# Altium project iMX6_Pixhawk.PrjPcb (part 1 of 6)
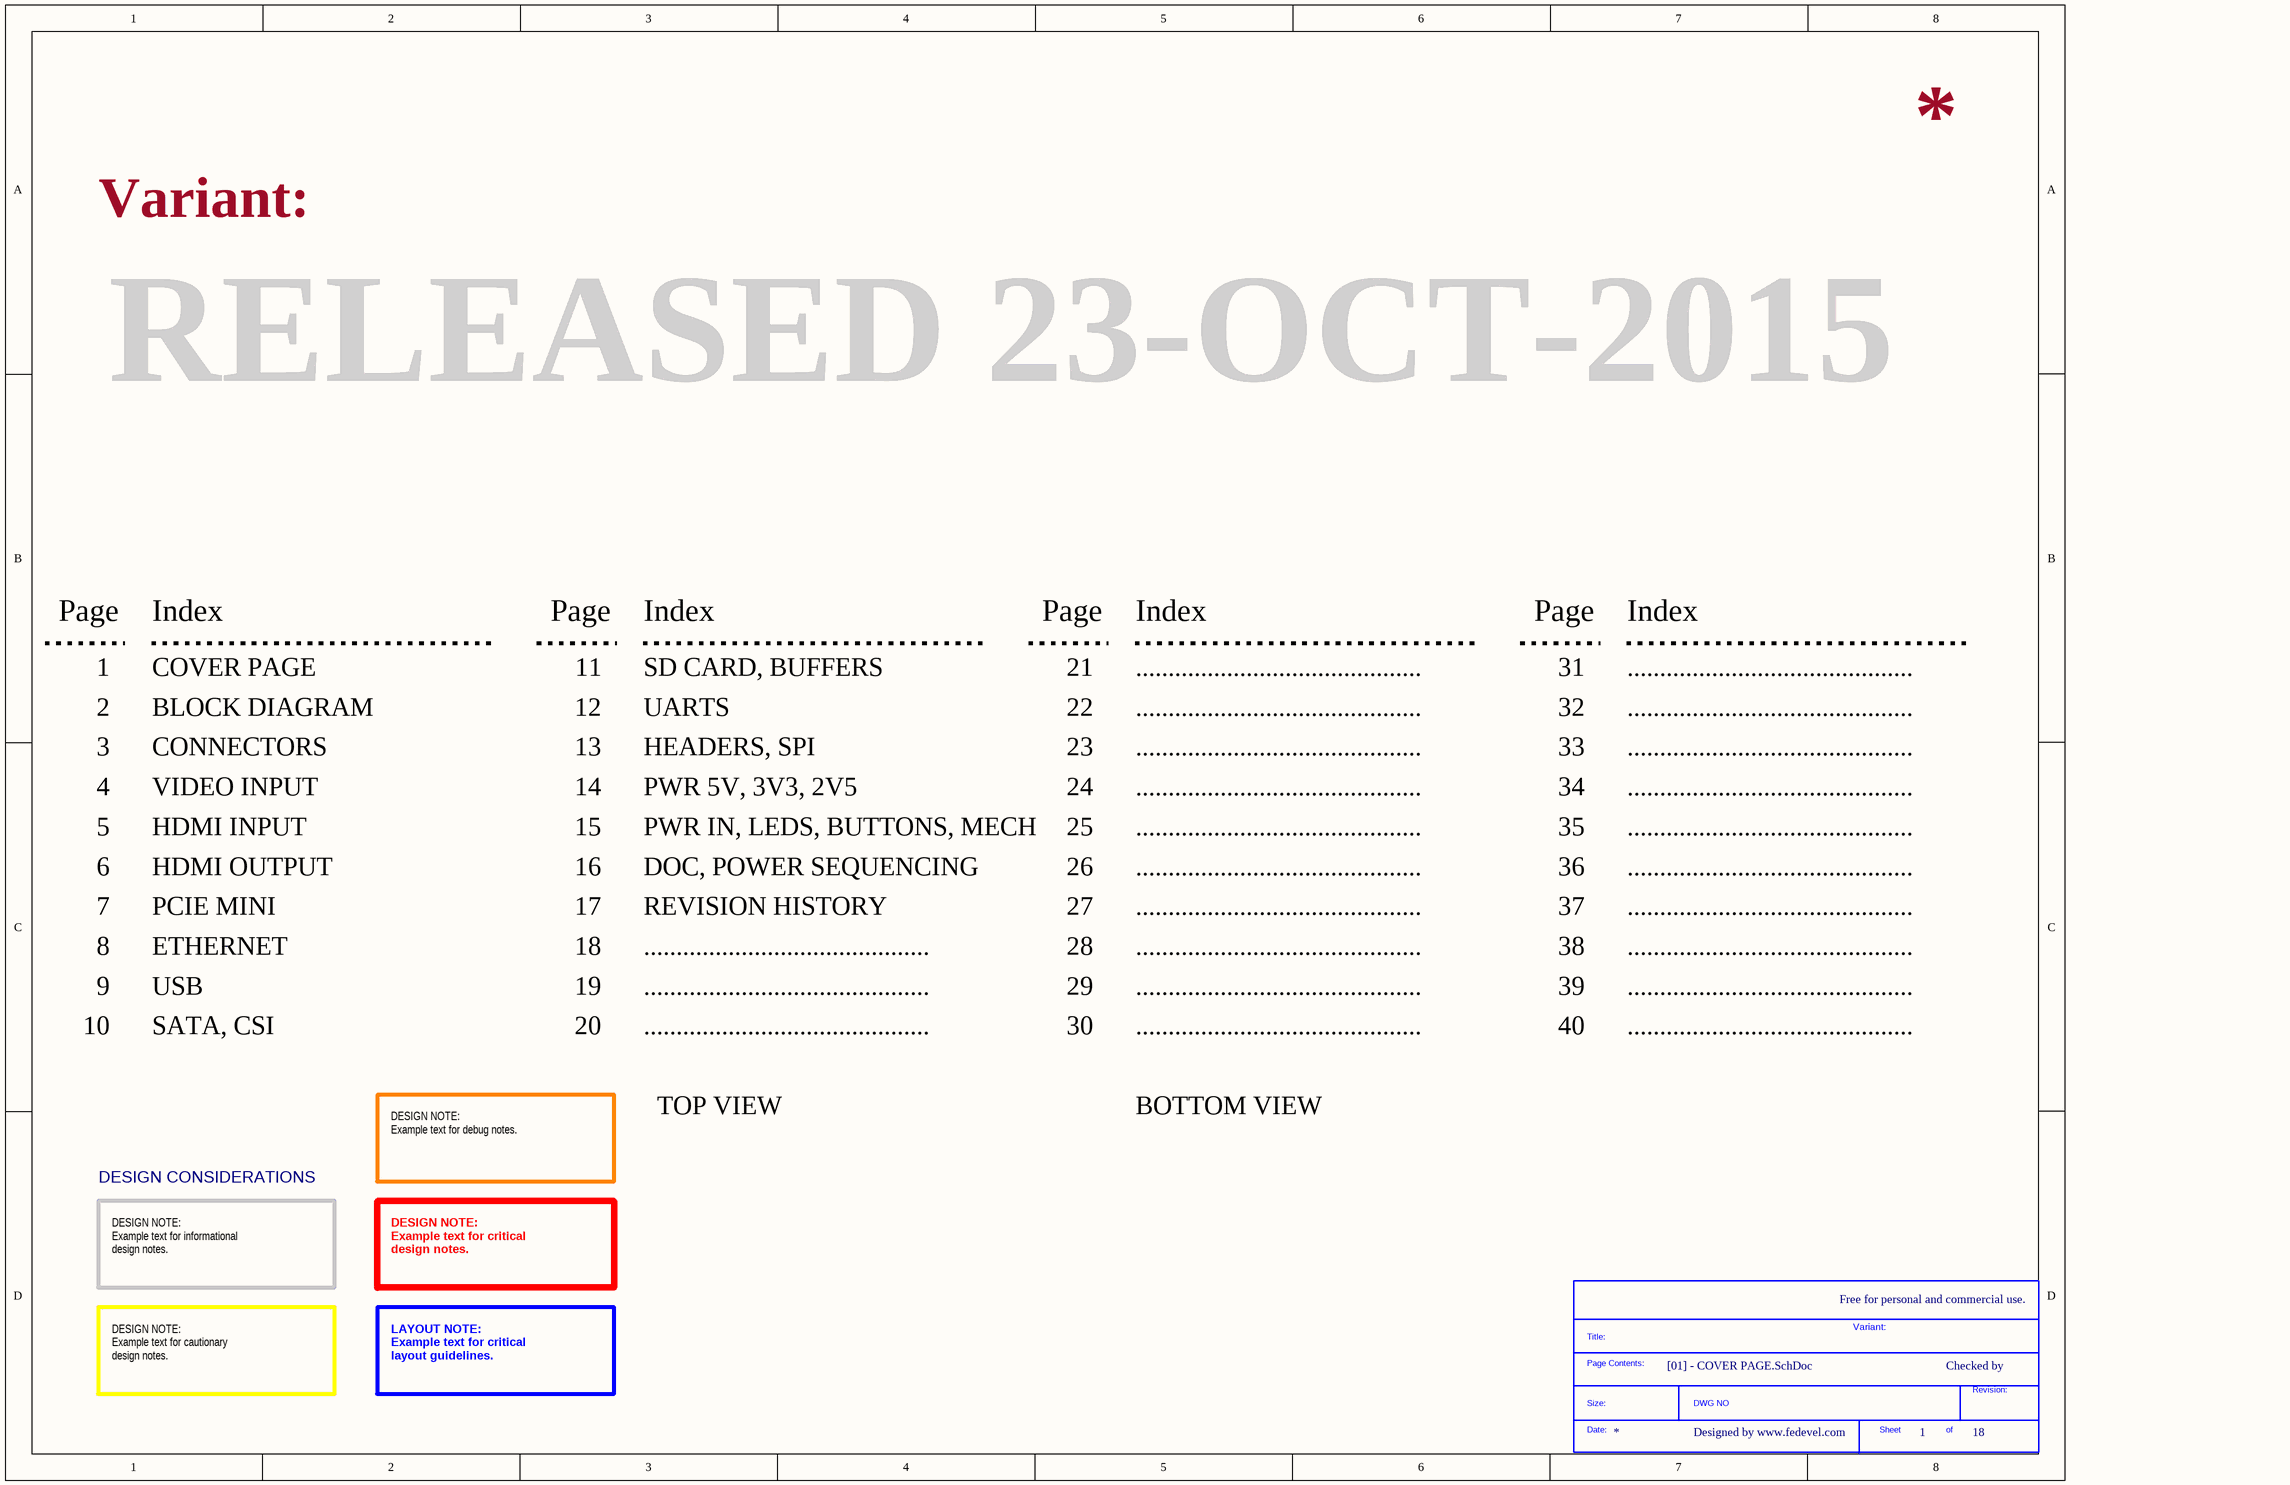
[diagram p0: [01] - COVER PAGE.SchDoc]
19 sheets, 385 parts. Net scope: global (net labels, ports and power ports of the same name join across sheets).
Board file: TinyHawk_PCB.PcbDoc
Sheets:
  [01] - COVER PAGE.SchDoc
  [02] - BLOCK DIAGRAM.SchDoc
  [03] - CONNECTORS.SchDoc
  [04] - VIDEO INPUT.SchDoc
  [05] - HDMI INPUT.SchDoc
  [07] - PCIE MINI.SchDoc
  [09] - USB.SchDoc
  [11] - SD CARD, BUFFERS.SchDoc
  [12] - UARTS.SchDoc
  [13] - HEADERS, SPI.SchDoc
  [14] - PWR 5V, 3V3, 2V5.SchDoc
  [15] - PWR IN, LEDS, BUTTONS, MECH.SchDoc
  [16] - CAN BUS.SchDoc
  [17] - PLUGS.SchDoc
  [18] - POWER.SchDoc
  [19] - FTDI.SchDoc
  [20] - SERVO.SchDoc
  [21] - TEST POINTS.SchDoc
  [22] - PIXHAWK CONNECTOR.SchDoc

## Sheet [01] - COVER PAGE.SchDoc
size A3; DocumentNumber: 1; SheetNumber: 1; SheetTotal: 18

### Parts
(Parts that share a designator on the sheet are numbered #1, #2 ... from top to bottom, then left to right.)
*#1  SDTitleBlock  (value not drawn)  (graphical)

### Notes on the sheet
- Variant:
- RELEASED 23-OCT-2015
- Page
- Index
- 1
- COVER PAGE
- 11
- SD CARD, BUFFERS
- 21
- ............................................
- 31
- 2
- 3
- BLOCK DIAGRAM
- CONNECTORS
- 12
- 13
- UARTS
- HEADERS, SPI
- 22
- 23
- 32
- 33
- 4
- 5
- VIDEO INPUT
- HDMI INPUT
- 14
- 15
- PWR 5V, 3V3, 2V5
- PWR IN, LEDS, BUTTONS, MECH
- 24
- 25
- 34
- 35
- 6
- HDMI OUTPUT
- 16
- DOC, POWER SEQUENCING
- 26
- 36
- 7
- 8
- PCIE MINI
- ETHERNET
- 17
- 18
- REVISION HISTORY
- 27
- 28
- 37
- 38
- 9
- 10
- USB
- SATA, CSI
- 19
- 20
- 29
- 30
- 39
- 40
- DESIGN NOTE:
  Example text for debug notes.
- TOP VIEW
- BOTTOM VIEW
- DESIGN CONSIDERATIONS
- DESIGN NOTE:
  Example text for informational
  design notes.
- DESIGN NOTE:
  Example text for critical
  design notes.
- Free for personal and commercial use.
- Checked by
- DESIGN NOTE:
  Example text for cautionary
  design notes.
- LAYOUT NOTE:
  Example text for critical
  layout guidelines.
- Designed by www.fedevel.com
- (in symbol SDTitleBlock) Title:; Page Contents:; Revision:; Size:; DWG NO; Date:; Sheet; of

## Sheet [02] - BLOCK DIAGRAM.SchDoc
size A2; DocumentNumber: 2; SheetNumber: 2; SheetTotal: 18; PageSetup: Record=PageOptions|CenterHorizontal=True|CenterVertical=True|PrintScale=0.73|XCorrection=1.00|YCorrection=1.00|PrintKind=1|BorderSize=5000000|LeftOffset=0|BottomOffset=0|Orientation=2|PaperLength=1000|PaperWidth=1000|Scale=100|PaperSource=4|PrintQuality=300|MediaType=1|DitherType=10|PrintScaleMode=1|PaperKind=A4|PaperIndex=9
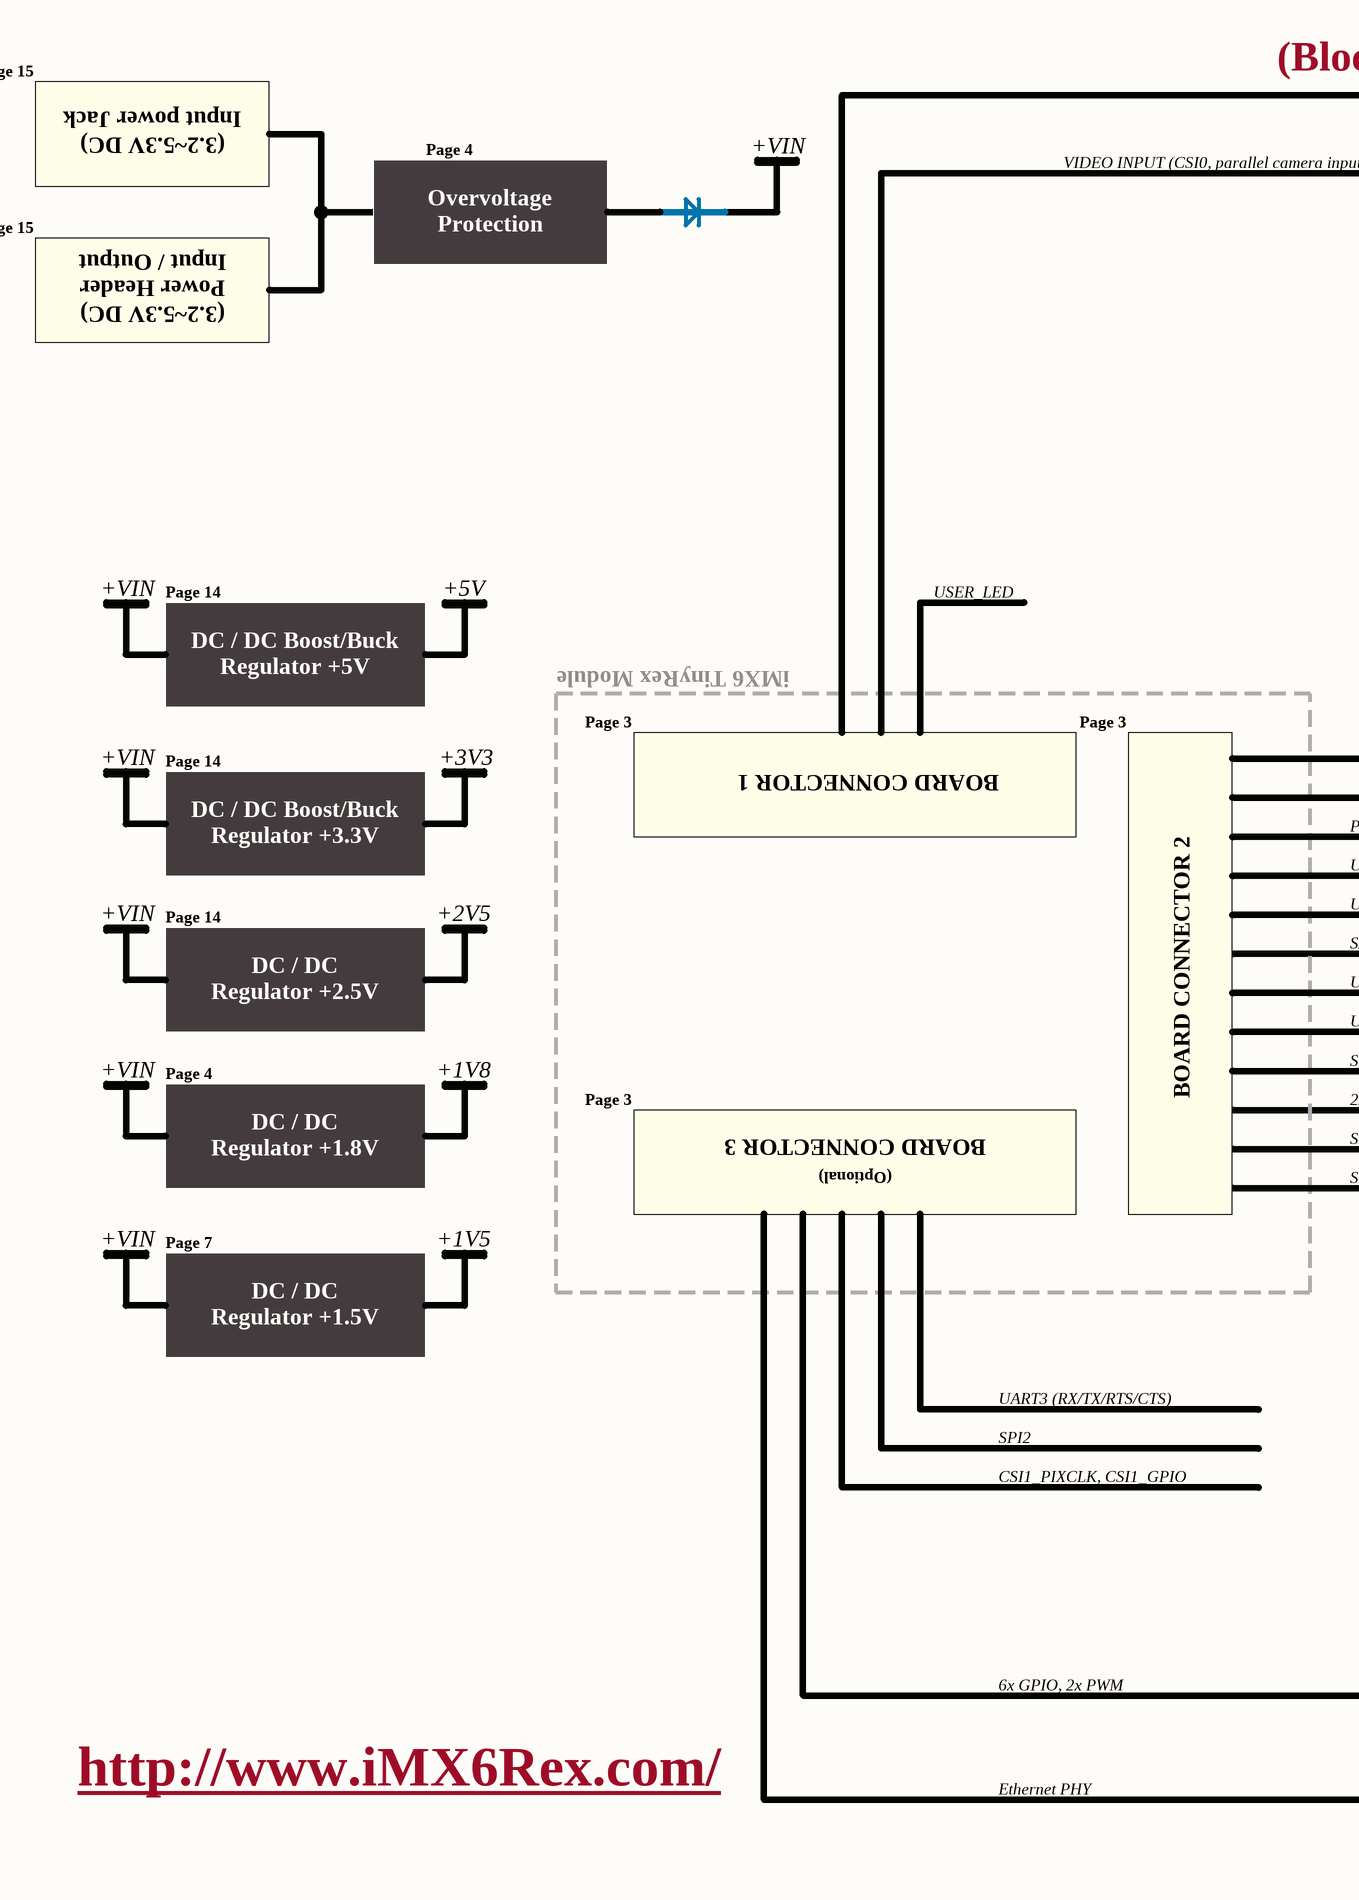
[diagram p1: [02] - BLOCK DIAGRAM.SchDoc, left]
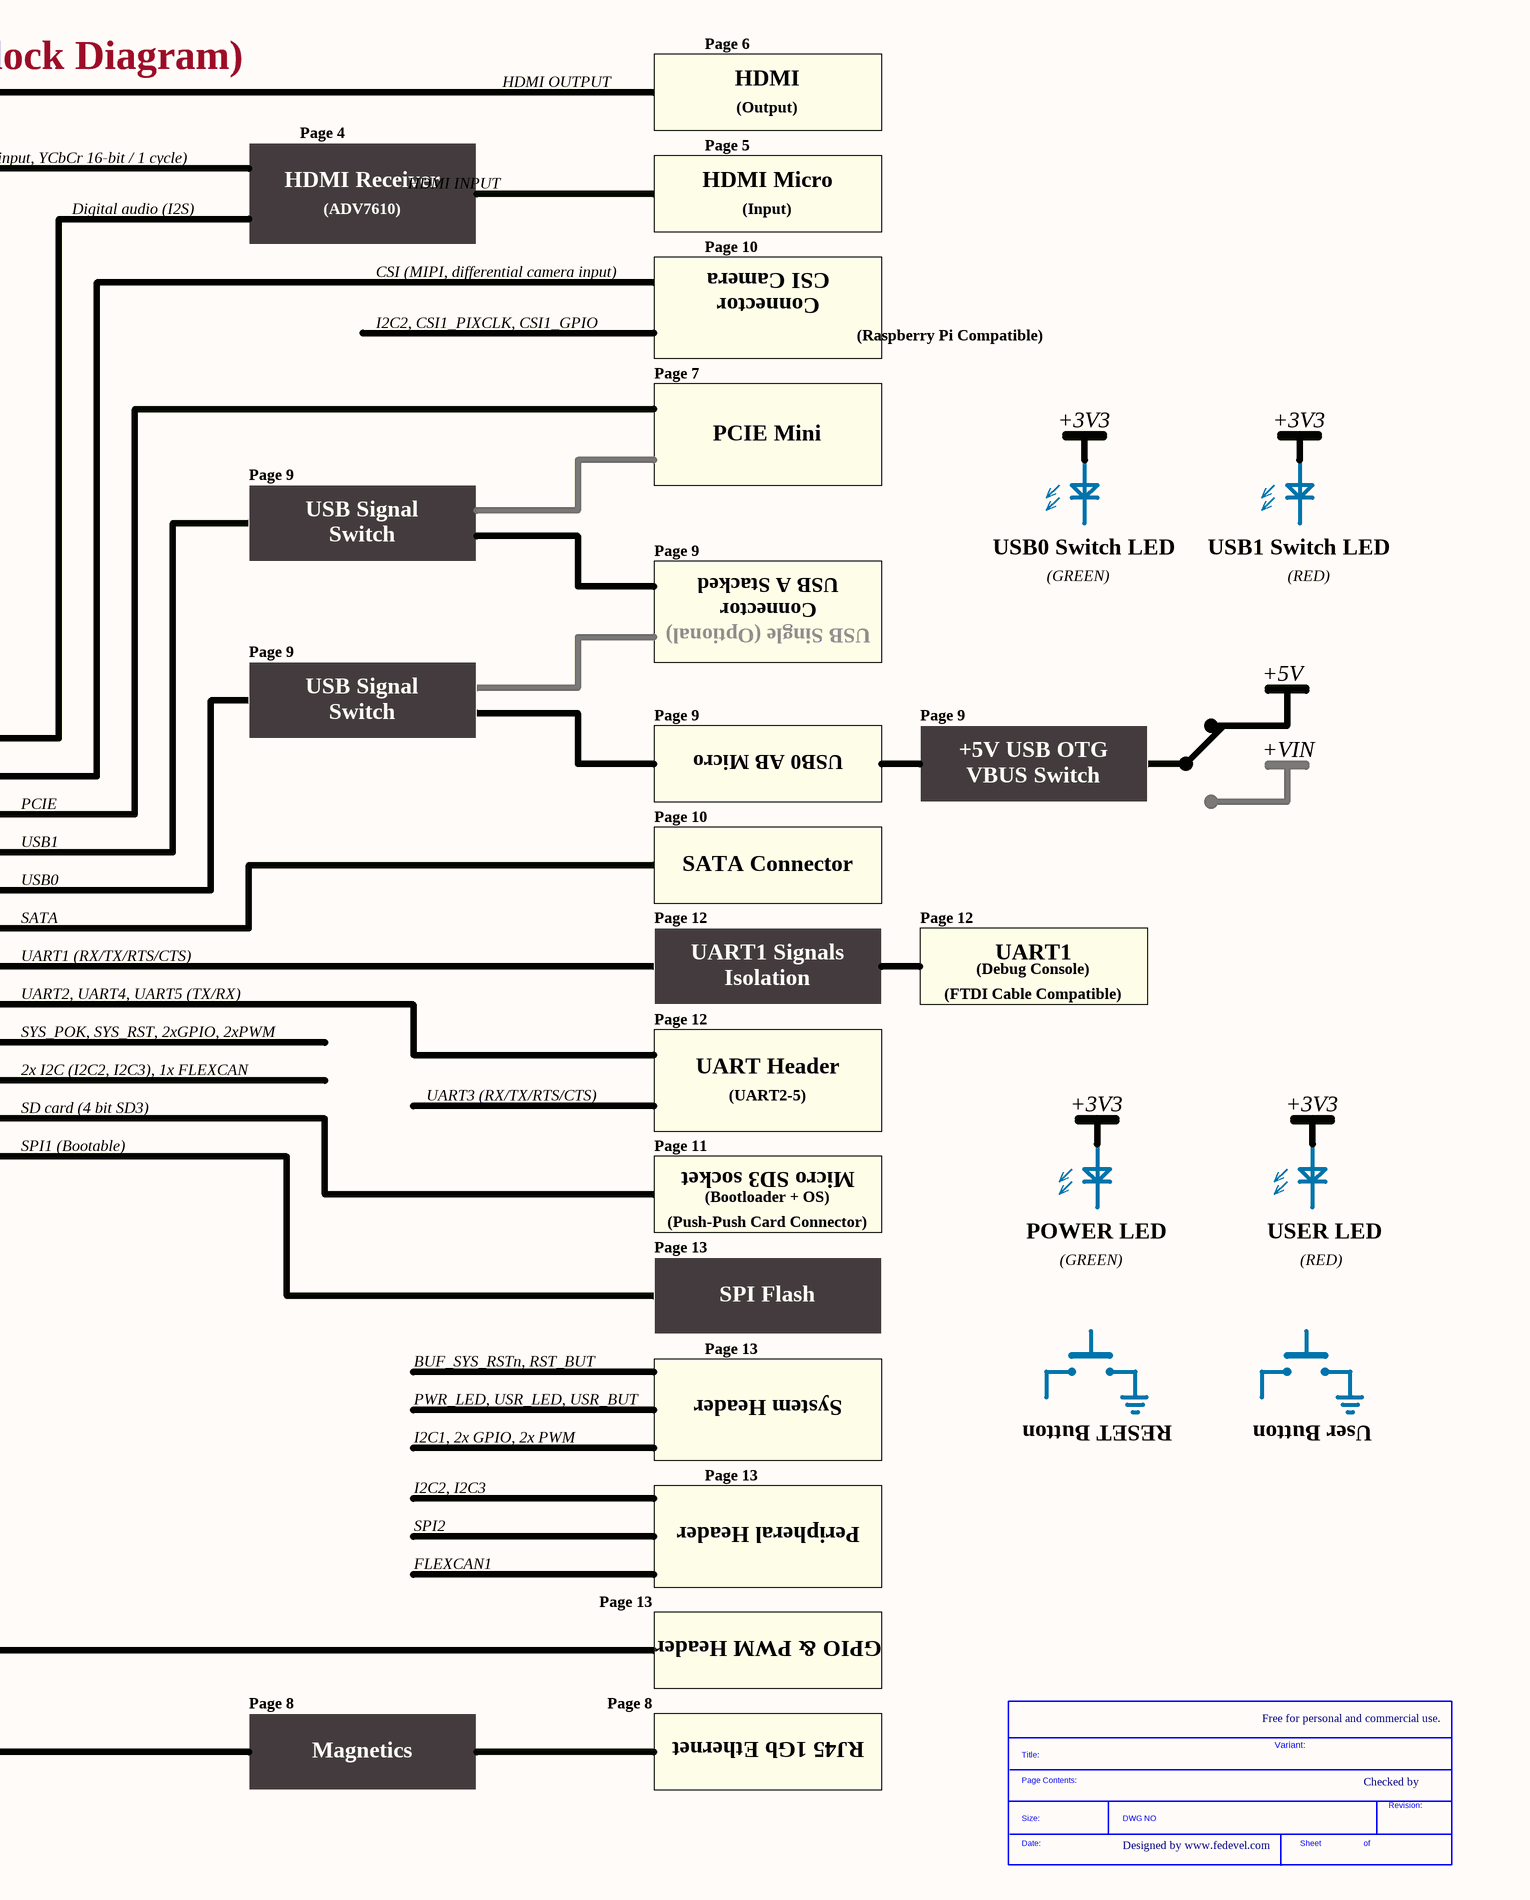
[diagram p2: [02] - BLOCK DIAGRAM.SchDoc, right]

### Parts
(Parts that share a designator on the sheet are numbered #1, #2 ... from top to bottom, then left to right.)
*#2  SDTitleBlock  (value not drawn)  (graphical)

### Notes on the sheet
- Page 15
- (Block Diagram)
- HDMI OUTPUT
- Page 6
- HDMI
- Input power Jack
- (3.2~5.3V DC)
- Page 4
- +VIN
- Page 5
- (Output)
- Overvoltage
- VIDEO INPUT (CSI0, parallel camera input, YCbCr 16-bit / 1 cycle)
- Digital audio (I2S)
- HDMI Receiver
- (ADV7610)
- HDMI INPUT
- HDMI Micro
- (Input)
- Input / Output
- Protection
- CSI (MIPI, differential camera input)
- Page 10
- Power Header
- I2C2, CSI1_PIXCLK, CSI1_GPIO
- CSI Camera
- Connector
- (Raspberry Pi Compatible)
- Page 7
- PCIE Mini
- +3V3
- Page 9
- USB Signal
- Page 14
- +5V
- USER_LED
- Switch
- USB A Stacked
- (GREEN)
- USB0 Switch LED
- (RED)
- USB1 Switch LED
- DC / DC Boost/Buck
- Regulator +5V
- USB Single (Optional)
- Page 3
- iMX6 TinyRex Module
- BOARD CONNECTOR 1
- USB0 AB Micro
- +5V USB OTG
- VBUS Switch
- Regulator +3.3V
- PCIE
- USB1
- +2V5
- USB0
- SATA Connector
- Regulator +2.5V
- DC / DC
- BOARD CONNECTOR 2
- SATA
- UART1 (RX/TX/RTS/CTS)
- Page 12
- UART1 Signals
- UART1
- (Debug Console)
- UART2, UART4, UART5 (TX/RX)
- SYS_POK, SYS_RST, 2xGPIO, 2xPWM
- Isolation
- (FTDI Cable Compatible)
- +1V8
- 2x I2C (I2C2, I2C3), 1x FLEXCAN
- UART3 (RX/TX/RTS/CTS)
- UART Header
- (UART2-5)
- Regulator +1.8V
- BOARD CONNECTOR 3
- (Optional)
- SD card (4 bit SD3)
- SPI1 (Bootable)
- Page 11
- +1V5
- Micro SD3 socket
- (Bootloader + OS)
- (Push-Push Card Connector)
- Regulator +1.5V
- Page 13
- POWER LED
- USER LED
- SPI Flash
- SPI2
- BUF_SYS_RSTn, RST_BUT
- PWR_LED, USR_LED, USR_BUT
- System Header
- CSI1_PIXCLK, CSI1_GPIO
- I2C1, 2x GPIO, 2x PWM
- RESET Button
- User Button
- I2C2, I2C3
- Peripheral Header
- FLEXCAN1
- 6x GPIO, 2x PWM
- GPIO & PWM Header
- Page 8
- Free for personal and commercial use.
- http://www.iMX6Rex.com/
- Ethernet PHY
- Magnetics
- RJ45 1Gb Ethernet
- Variant:
- Checked by
- Designed by www.fedevel.com
- (in symbol SDTitleBlock) Title:; Page Contents:; Revision:; Size:; DWG NO; Date:; Sheet; of

## Sheet [03] - CONNECTORS.SchDoc
size A2; DocumentNumber: 3; SheetNumber: 3; SheetTotal: 18
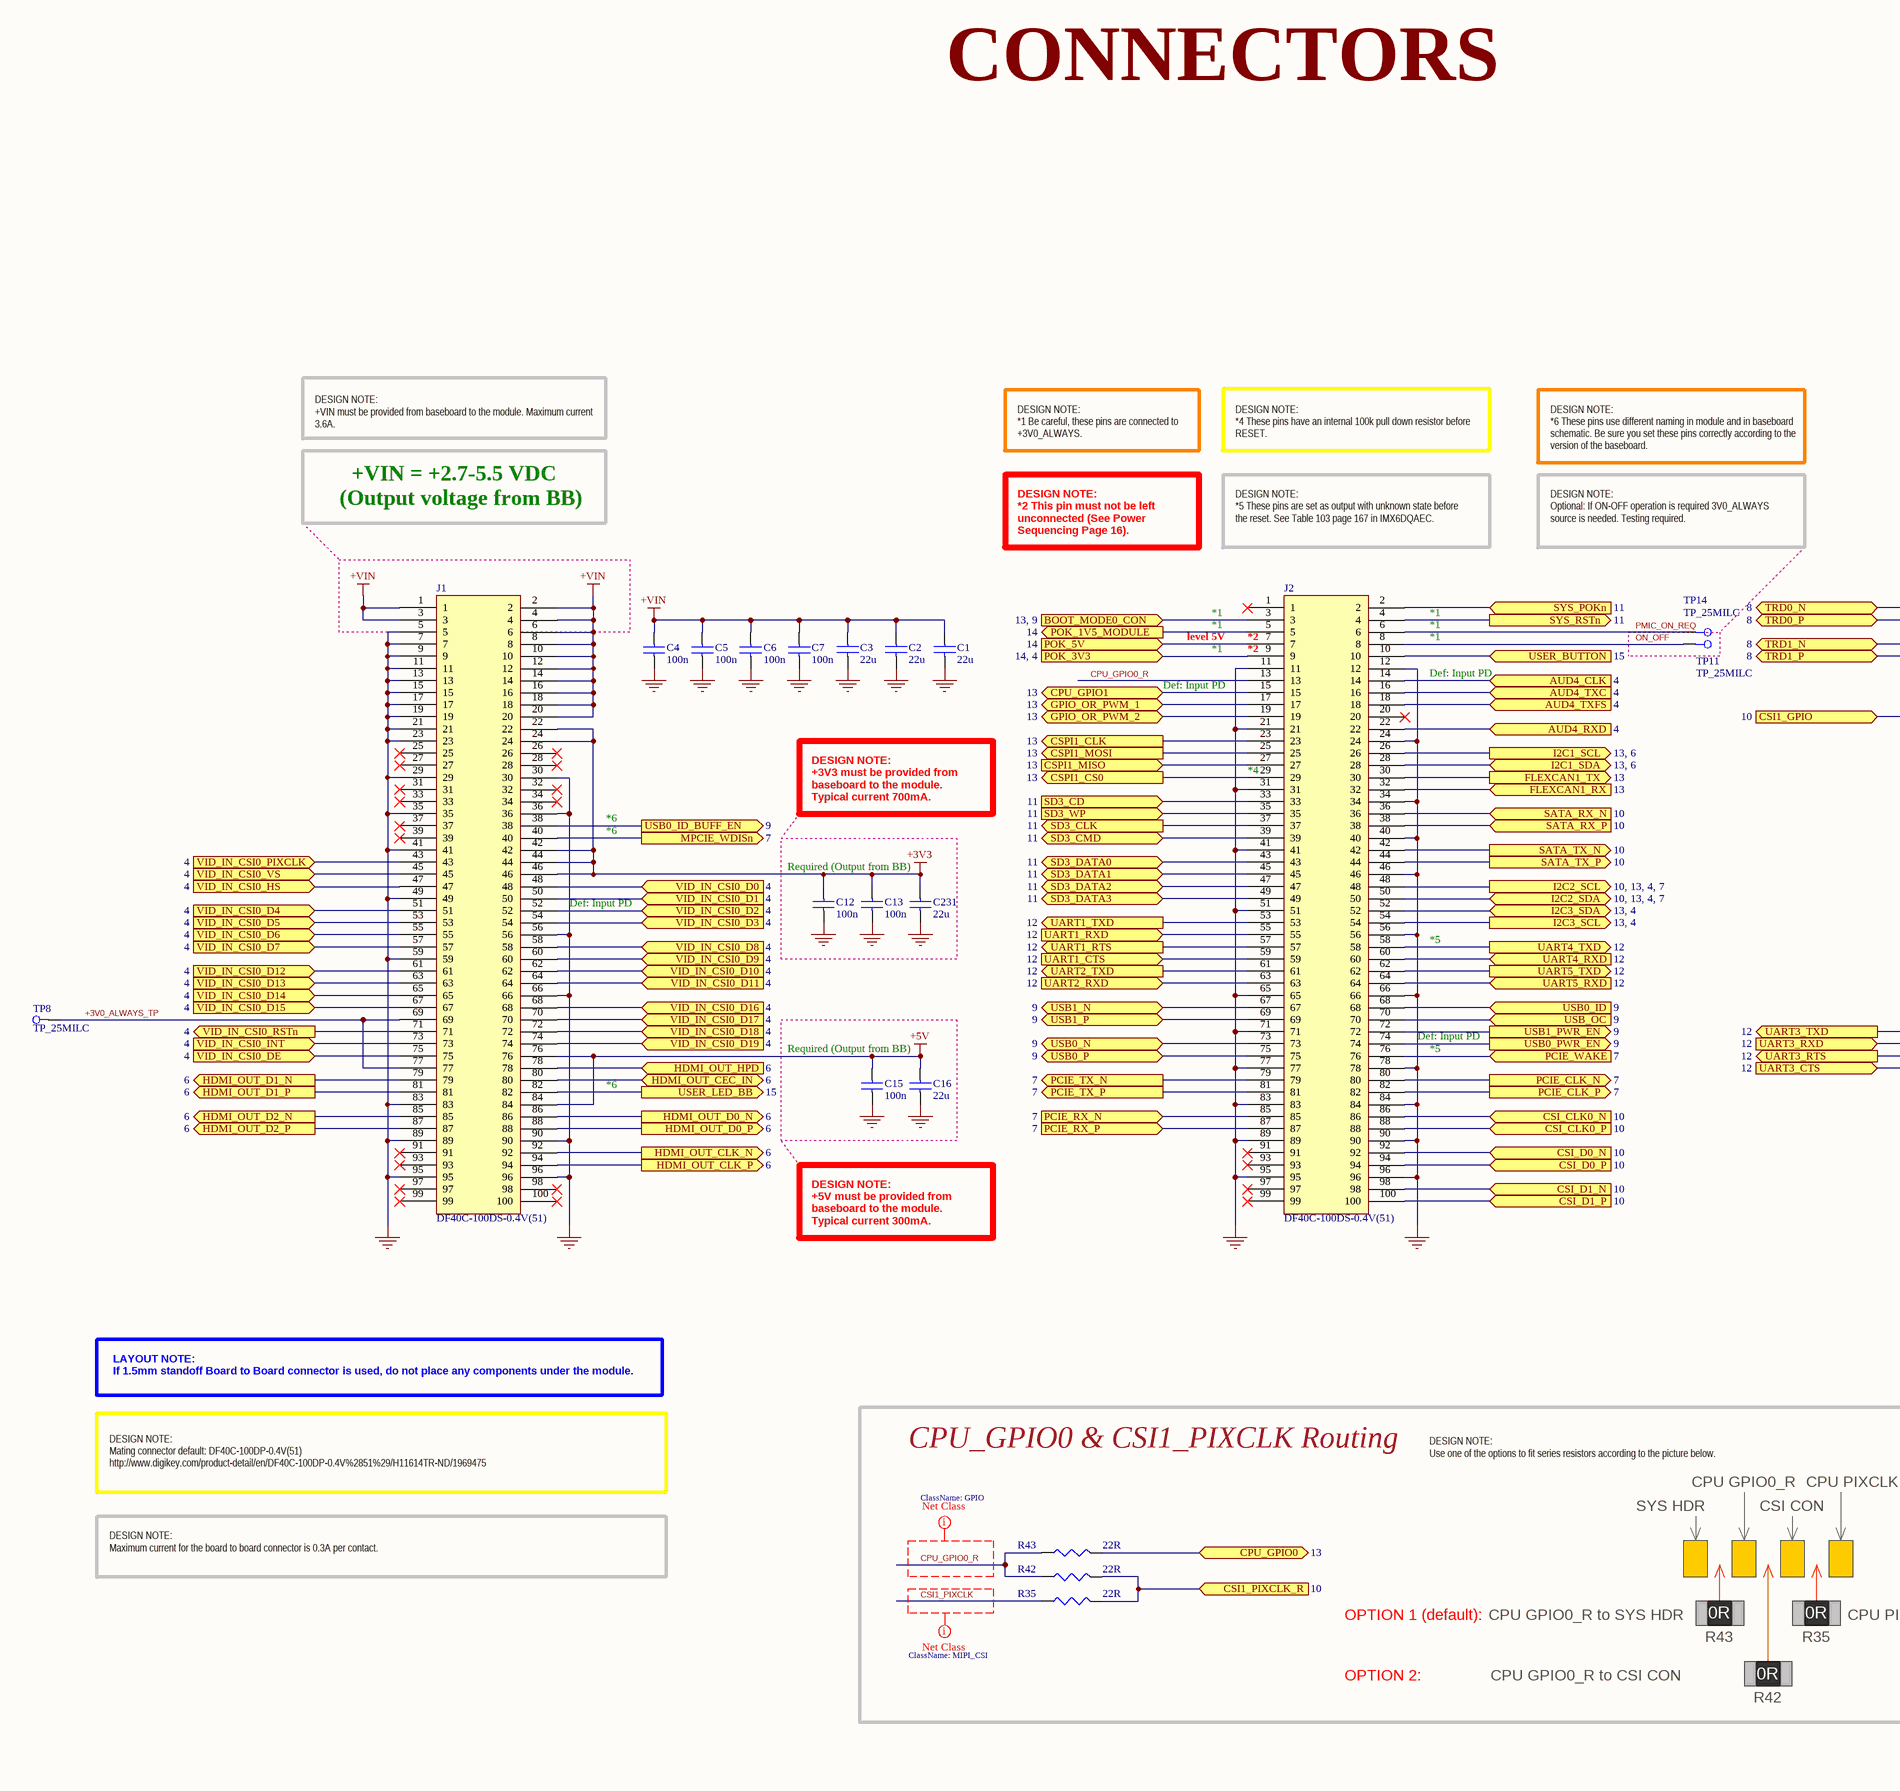
[diagram p3: [03] - CONNECTORS.SchDoc, left]
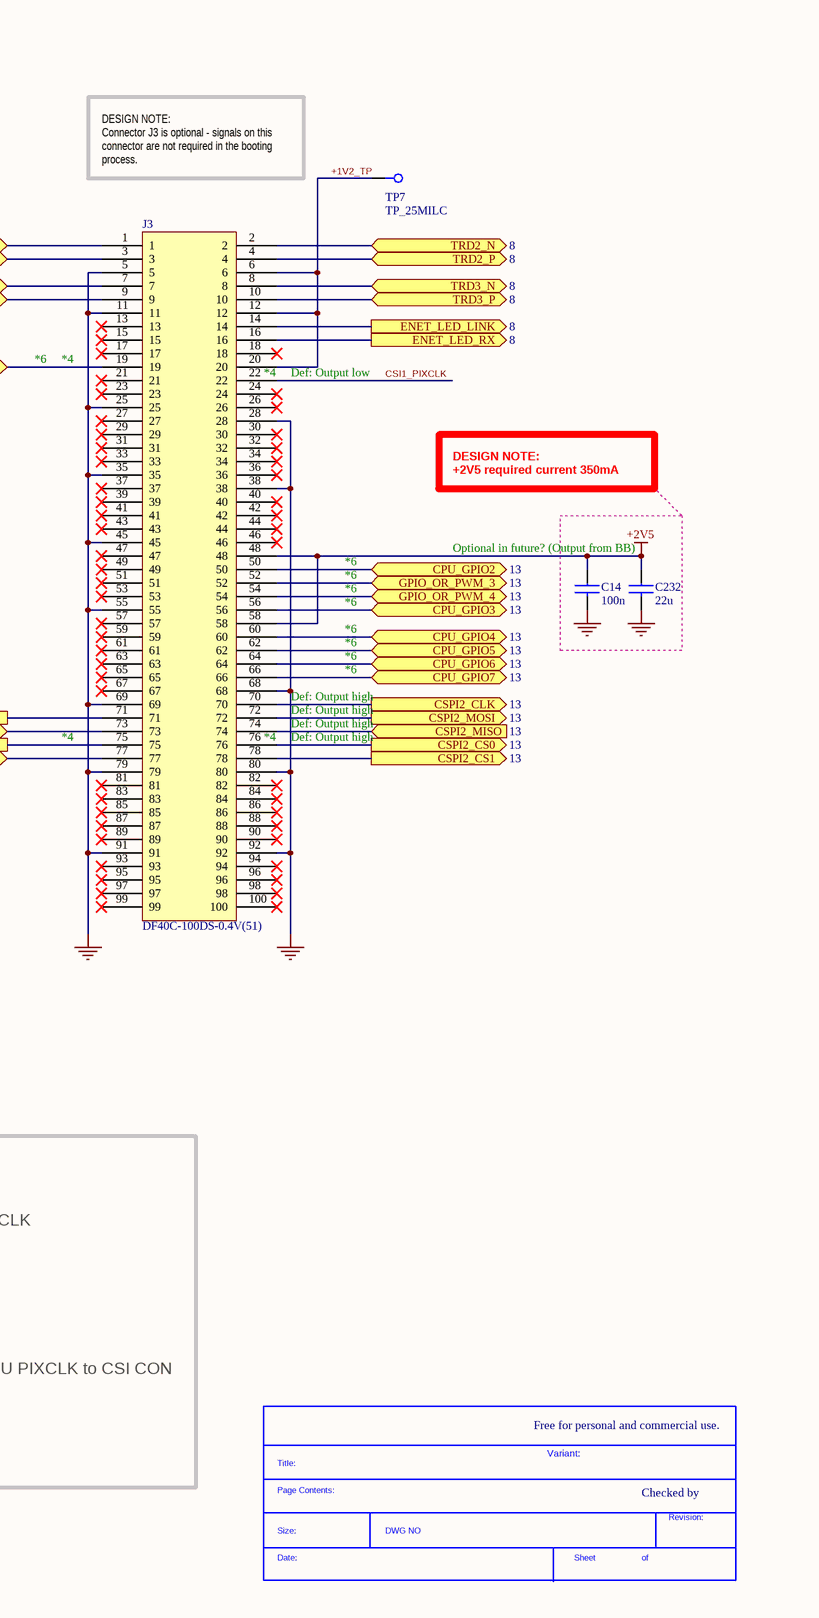
[diagram p4: [03] - CONNECTORS.SchDoc, right]

### Parts
(Parts that share a designator on the sheet are numbered #1, #2 ... from top to bottom, then left to right.)
*#3  SDTitleBlock  (value not drawn)  (graphical)
C1  22u  [C0603]
C2  22u  [C0603]
C3  22u  [C0603]
C4  100n  [C0402]
C5  100n  [C0402]
C6  100n  [C0402]
C7  100n  [C0402]
C12  100n  [C0402]
C13  100n  [C0402]
C14  100n  [C0402]
C15  100n  [C0402]
C16  22u  [C0603]
C231  22u  [C0603]
C232  22u  [C0603]
J1  DF40C-100DS-0.4V(51)  [DF40C-100DS-0.4V(51)_V1.1]
J2  DF40C-100DS-0.4V(51)  [DF40C-100DS-0.4V(51)_V1.1]
J3  DF40C-100DS-0.4V(51)  [DF40C-100DS-0.4V(51)_V1.1]
R35  22R  [R0402]
R42  22R  [R0402]
R43  22R  [R0402]
TP7  TP_25MILC  [TP_25C]  (no BOM)
TP8  TP_25MILC  [TP_25C]  (no BOM)
TP11  TP_25MILC  [TP_25C]  (no BOM)
TP14  TP_25MILC  [TP_25C]  (no BOM)

### Blocks framed on the sheet
Required (Output from BB): C12 C13 C231
Required (Output from BB): C15 C16
CPU_GPIO0 & CSI1_PIXCLK Routing: R35 R42 R43

### Ports
AUD4_CLK (in, see 4), AUD4_RXD (in, see 4), AUD4_TXC (in, see 4), AUD4_TXFS (in, see 4), BOOT_MODE0_CON (see 13, 9), CPU_GPIO0 (bidir, see 13), CPU_GPIO1 (bidir, see 13), CPU_GPIO2 (bidir, see 13), CPU_GPIO3 (bidir, see 13), CPU_GPIO4 (bidir, see 13), CPU_GPIO5 (bidir, see 13), CPU_GPIO6 (bidir, see 13), CPU_GPIO7 (bidir, see 13), CSI1_GPIO (in, see 10), CSI1_PIXCLK_R (in, see 10), CSI_CLK0_N (in, see 10), CSI_CLK0_P (in, see 10), CSI_D0_N (in, see 10), CSI_D0_P (in, see 10), CSI_D1_N (in, see 10), CSI_D1_P (in, see 10), CSPI1_CLK (out, see 13), CSPI1_CS0 (out, see 13), CSPI1_MISO (in, see 13), CSPI1_MOSI (out, see 13), CSPI2_CLK (out, see 13), CSPI2_CS0 (out, see 13), CSPI2_CS1 (out, see 13), CSPI2_MISO (in, see 13), CSPI2_MOSI (out, see 13), ENET_LED_LINK (out, see 8), ENET_LED_RX (out, see 8), FLEXCAN1_RX (in, see 13), FLEXCAN1_TX (out, see 13), GPIO_OR_PWM_1 (bidir, see 13), GPIO_OR_PWM_2 (bidir, see 13), GPIO_OR_PWM_3 (bidir, see 13), GPIO_OR_PWM_4 (bidir, see 13), HDMI_OUT_CEC_IN (bidir, see 6), HDMI_OUT_CLK_N (out, see 6), HDMI_OUT_CLK_P (out, see 6), HDMI_OUT_D0_N (out, see 6), HDMI_OUT_D0_P (out, see 6), HDMI_OUT_D1_N (out, see 6), HDMI_OUT_D1_P (out, see 6), HDMI_OUT_D2_N (out, see 6), HDMI_OUT_D2_P (out, see 6), HDMI_OUT_HPD (in, see 6), I2C1_SCL (see 13, 6), I2C1_SDA (bidir, see 13, 6), I2C2_SCL (see 10, 13, 4, 7), I2C2_SDA (bidir, see 10, 13, 4, 7), I2C3_SCL (see 13, 4), I2C3_SDA (bidir, see 13, 4), MPCIE_WDISn (out, see 7), PCIE_CLK_N (out, see 7), PCIE_CLK_P (out, see 7), PCIE_RX_N (in, see 7), PCIE_RX_P (in, see 7), PCIE_TX_N (out, see 7), PCIE_TX_P (out, see 7), PCIE_WAKE (in, see 7), POK_1V5_MODULE (out, see 14), POK_3V3 (see 14, 4), POK_5V (in, see 14), SATA_RX_N (in, see 10), SATA_RX_P (in, see 10), SATA_TX_N (out, see 10), SATA_TX_P (out, see 10), SD3_CD (in, see 11), SD3_CLK (out, see 11), SD3_CMD (bidir, see 11), SD3_DATA0 (bidir, see 11), SD3_DATA1 (bidir, see 11), SD3_DATA2 (bidir, see 11), SD3_DATA3 (bidir, see 11), SD3_WP (in, see 11), SYS_POKn (in, see 11), SYS_RSTn (out, see 11), TRD0_N (bidir, see 8), TRD0_P (bidir, see 8), TRD1_N (bidir, see 8), TRD1_P (bidir, see 8), TRD2_N (bidir, see 8), TRD2_P (bidir, see 8), TRD3_N (bidir, see 8), TRD3_P (bidir, see 8), UART1_CTS (in, see 12), UART1_RTS (out, see 12), UART1_RXD (in, see 12), UART1_TXD (out, see 12), UART2_RXD (in, see 12), UART2_TXD (out, see 12), UART3_CTS (in, see 12), UART3_RTS (out, see 12), UART3_RXD (in, see 12), UART3_TXD (out, see 12), UART4_RXD (in, see 12), UART4_TXD (out, see 12), UART5_RXD (in, see 12), UART5_TXD (out, see 12), USB0_ID (in, see 9), USB0_ID_BUFF_EN (out, see 9), USB0_N (bidir, see 9), USB0_P (bidir, see 9), USB0_PWR_EN (out, see 9), USB1_N (bidir, see 9), USB1_P (bidir, see 9), USB1_PWR_EN (out, see 9), USB_OC (in, see 9), USER_BUTTON (in, see 15), USER_LED_BB (out, see 15), VID_IN_CSI0_D0 (in, see 4), VID_IN_CSI0_D1 (in, see 4), VID_IN_CSI0_D2 (in, see 4), VID_IN_CSI0_D3 (in, see 4), VID_IN_CSI0_D4 (in, see 4), VID_IN_CSI0_D5 (in, see 4), VID_IN_CSI0_D6 (in, see 4), VID_IN_CSI0_D7 (in, see 4), VID_IN_CSI0_D8 (in, see 4), VID_IN_CSI0_D9 (in, see 4), VID_IN_CSI0_D10 (in, see 4), VID_IN_CSI0_D11 (in, see 4), VID_IN_CSI0_D12 (in, see 4), VID_IN_CSI0_D13 (in, see 4), VID_IN_CSI0_D14 (in, see 4), VID_IN_CSI0_D15 (in, see 4), VID_IN_CSI0_D16 (in, see 4), VID_IN_CSI0_D17 (in, see 4), VID_IN_CSI0_D18 (in, see 4), VID_IN_CSI0_D19 (in, see 4), VID_IN_CSI0_DE (in, see 4), VID_IN_CSI0_HS (in, see 4), VID_IN_CSI0_INT (in, see 4), VID_IN_CSI0_PIXCLK (in, see 4), VID_IN_CSI0_RSTn (out, see 4), VID_IN_CSI0_VS (in, see 4)

### Nets
+2V5: C14.1 C232.1 J3.48 J3.58
+3V3: C12.1 C13.1 C231.1 J1.22 J1.24 J1.42 J1.44 J1.46
+5V: C15.1 C16.1 J1.76 J1.84
+VIN: C1.1 C2.1 C3.1 C4.1 C5.1 C6.1 C7.1 J1.1 J1.2 J1.3 J1.4 J1.6 J1.8 J1.10 J1.12 J1.14 J1.16 J1.18 J1.20
GND: C1.2 C2.2 C3.2 C4.2 C5.2 C6.2 C7.2 C12.2 C13.2 C14.2 C15.2 C16.2 C231.2 C232.2 J1.5 J1.7 J1.9 J1.11 J1.13 J1.15 J1.17 J1.19 J1.21 J1.23 J1.29 J1.30 J1.35 J1.36 J1.41 J1.49 J1.56 J1.59 J1.66 J1.83 J1.89 J1.90 J1.95 J1.96 J2.11 J2.12 J2.21 J2.24 J2.31 J2.34 J2.40 J2.41 J2.46 J2.51 J2.56 J2.65 J2.66 J2.71 J2.77 J2.78 J2.83 J2.84 J2.89 J2.90 J2.95 J2.96 J3.5 J3.11 J3.25 J3.28 J3.35 J3.38 J3.45 J3.55 J3.68 J3.69 J3.79 J3.80 J3.91 J3.92
+1V2_TP: J3.6 J3.12 J3.20 TP7.1
+3V0_ALWAYS_TP: J1.69 J1.77 TP8.1
CPU_GPIO0: R43.2 ; port CPU_GPIO0
CPU_GPIO0_R: J2.13 R42.1 R43.1
CPU_GPIO1: J2.15 ; port CPU_GPIO1
CPU_GPIO2: J3.50 ; port CPU_GPIO2
CPU_GPIO3: J3.56 ; port CPU_GPIO3
CPU_GPIO4: J3.60 ; port CPU_GPIO4
CPU_GPIO5: J3.62 ; port CPU_GPIO5
CPU_GPIO6: J3.64 ; port CPU_GPIO6
CPU_GPIO7: J3.66 ; port CPU_GPIO7
CSI1_PIXCLK: J3.22 R35.1
CSPI1_CLK: J2.23 ; port CSPI1_CLK
CSPI1_CS0: J2.29 ; port CSPI1_CS0
CSPI1_MISO: J2.27 ; port CSPI1_MISO
CSPI1_MOSI: J2.25 ; port CSPI1_MOSI
CSPI2_CLK: J3.70 ; port CSPI2_CLK
CSPI2_CS0: J3.76 ; port CSPI2_CS0
CSPI2_CS1: J3.78 ; port CSPI2_CS1
CSPI2_MISO: J3.74 ; port CSPI2_MISO
CSPI2_MOSI: J3.72 ; port CSPI2_MOSI
FLEXCAN1_RX: J2.32 ; port FLEXCAN1_RX
FLEXCAN1_TX: J2.30 ; port FLEXCAN1_TX
GPIO_OR_PWM_1: J2.17 ; port GPIO_OR_PWM_1
GPIO_OR_PWM_2: J2.19 ; port GPIO_OR_PWM_2
GPIO_OR_PWM_3: J3.52 ; port GPIO_OR_PWM_3
GPIO_OR_PWM_4: J3.54 ; port GPIO_OR_PWM_4
I2C1_SCL: J2.26 ; port I2C1_SCL
I2C1_SDA: J2.28 ; port I2C1_SDA
I2C2_SCL: J2.48 ; port I2C2_SCL
I2C2_SDA: J2.50 ; port I2C2_SDA
I2C3_SCL: J2.54 ; port I2C3_SCL
I2C3_SDA: J2.52 ; port I2C3_SDA
ON_OFF: J2.8 TP11.1
PCIE_CLK_N: J2.80 ; port PCIE_CLK_N
PCIE_CLK_P: J2.82 ; port PCIE_CLK_P
PCIE_RX_N: J2.85 ; port PCIE_RX_N
PCIE_RX_P: J2.87 ; port PCIE_RX_P
PCIE_TX_N: J2.79 ; port PCIE_TX_N
PCIE_TX_P: J2.81 ; port PCIE_TX_P
PCIE_WAKE: J2.76 ; port PCIE_WAKE
PMIC_ON_REQ: J2.6 TP14.1
POK_1V5_MODULE: J2.5 ; port POK_1V5_MODULE
SD3_CD: J2.33 ; port SD3_CD
SD3_CLK: J2.37 ; port SD3_CLK
SD3_CMD: J2.39 ; port SD3_CMD
SD3_DATA0: J2.43 ; port SD3_DATA0
SD3_DATA1: J2.45 ; port SD3_DATA1
SD3_DATA2: J2.47 ; port SD3_DATA2
SD3_DATA3: J2.49 ; port SD3_DATA3
SD3_WP: J2.35 ; port SD3_WP
UART1_RXD: J2.55 ; port UART1_RXD
UART1_TXD: J2.53 ; port UART1_TXD
UART2_RXD: J2.63 ; port UART2_RXD
UART2_TXD: J2.61 ; port UART2_TXD
UART4_RXD: J2.60 ; port UART4_RXD
UART4_TXD: J2.58 ; port UART4_TXD
UART5_RXD: J2.64 ; port UART5_RXD
UART5_TXD: J2.62 ; port UART5_TXD
USB0_ID: J2.68 ; port USB0_ID
USB0_N: J2.73 ; port USB0_N
USB0_P: J2.75 ; port USB0_P
USB1_N: J2.67 ; port USB1_N
USB1_P: J2.69 ; port USB1_P
VID_IN_CSI0_D0: J1.48 ; port VID_IN_CSI0_D0
VID_IN_CSI0_D1: J1.50 ; port VID_IN_CSI0_D1
VID_IN_CSI0_D2: J1.52 ; port VID_IN_CSI0_D2
VID_IN_CSI0_D3: J1.54 ; port VID_IN_CSI0_D3
VID_IN_CSI0_D4: J1.51 ; port VID_IN_CSI0_D4
VID_IN_CSI0_D5: J1.53 ; port VID_IN_CSI0_D5
VID_IN_CSI0_D6: J1.55 ; port VID_IN_CSI0_D6
VID_IN_CSI0_D7: J1.57 ; port VID_IN_CSI0_D7
VID_IN_CSI0_D8: J1.58 ; port VID_IN_CSI0_D8
VID_IN_CSI0_D9: J1.60 ; port VID_IN_CSI0_D9
VID_IN_CSI0_D10: J1.62 ; port VID_IN_CSI0_D10
VID_IN_CSI0_D11: J1.64 ; port VID_IN_CSI0_D11
VID_IN_CSI0_D12: J1.61 ; port VID_IN_CSI0_D12
VID_IN_CSI0_D13: J1.63 ; port VID_IN_CSI0_D13
VID_IN_CSI0_D14: J1.65 ; port VID_IN_CSI0_D14
VID_IN_CSI0_D15: J1.67 ; port VID_IN_CSI0_D15
VID_IN_CSI0_D16: J1.68 ; port VID_IN_CSI0_D16
VID_IN_CSI0_D17: J1.70 ; port VID_IN_CSI0_D17
VID_IN_CSI0_D18: J1.72 ; port VID_IN_CSI0_D18
VID_IN_CSI0_D19: J1.74 ; port VID_IN_CSI0_D19
VID_IN_CSI0_DE: J1.75 ; port VID_IN_CSI0_DE
VID_IN_CSI0_HS: J1.47 ; port VID_IN_CSI0_HS
VID_IN_CSI0_INT: J1.73 ; port VID_IN_CSI0_INT
VID_IN_CSI0_PIXCLK: J1.43 ; port VID_IN_CSI0_PIXCLK
VID_IN_CSI0_RSTn: J1.71 ; port VID_IN_CSI0_RSTn
VID_IN_CSI0_VS: J1.45 ; port VID_IN_CSI0_VS
NetC200_1: J2.10 ; port USER_BUTTON
NetJ1_38: J1.38 ; port USB0_ID_BUFF_EN
NetJ1_40: J1.40 ; port MPCIE_WDISn
NetJ1_78: J1.78 ; port HDMI_OUT_HPD
NetJ1_79: J1.79 ; port HDMI_OUT_D1_N
NetJ1_80: J1.80 ; port HDMI_OUT_CEC_IN
NetJ1_81: J1.81 ; port HDMI_OUT_D1_P
NetJ1_82: J1.82 ; port USER_LED_BB
NetJ1_85: J1.85 ; port HDMI_OUT_D2_N
NetJ1_86: J1.86 ; port HDMI_OUT_D0_N
NetJ1_87: J1.87 ; port HDMI_OUT_D2_P
NetJ1_88: J1.88 ; port HDMI_OUT_D0_P
NetJ1_92: J1.92 ; port HDMI_OUT_CLK_N
NetJ1_94: J1.94 ; port HDMI_OUT_CLK_P
NetJ2_2: J2.2 ; port SYS_POKn
NetJ2_3: J2.3 ; port BOOT_MODE0_CON
NetJ2_4: J2.4 ; port SYS_RSTn
NetJ2_7: J2.7 ; port POK_5V
NetJ2_9: J2.9 ; port POK_3V3
NetJ2_14: J2.14 ; port AUD4_CLK
NetJ2_16: J2.16 ; port AUD4_TXC
NetJ2_18: J2.18 ; port AUD4_TXFS
NetJ2_22: J2.22 ; port AUD4_RXD
NetJ2_36: J2.36 ; port SATA_RX_N
NetJ2_38: J2.38 ; port SATA_RX_P
NetJ2_42: J2.42 ; port SATA_TX_N
NetJ2_44: J2.44 ; port SATA_TX_P
NetJ2_57: J2.57 ; port UART1_RTS
NetJ2_59: J2.59 ; port UART1_CTS
NetJ2_70: J2.70 ; port USB_OC
NetJ2_72: J2.72 ; port USB1_PWR_EN
NetJ2_74: J2.74 ; port USB0_PWR_EN
NetJ2_86: J2.86 ; port CSI_CLK0_N
NetJ2_88: J2.88 ; port CSI_CLK0_P
NetJ2_92: J2.92 ; port CSI_D0_N
NetJ2_94: J2.94 ; port CSI_D0_P
NetJ2_98: J2.98 ; port CSI_D1_N
NetJ2_100: J2.100 ; port CSI_D1_P
NetJ3_1: J3.1 ; port TRD0_N
NetJ3_2: J3.2 ; port TRD2_N
NetJ3_3: J3.3 ; port TRD0_P
NetJ3_4: J3.4 ; port TRD2_P
NetJ3_7: J3.7 ; port TRD1_N
NetJ3_8: J3.8 ; port TRD3_N
NetJ3_9: J3.9 ; port TRD1_P
NetJ3_10: J3.10 ; port TRD3_P
NetJ3_14: J3.14 ; port ENET_LED_LINK
NetJ3_16: J3.16 ; port ENET_LED_RX
NetJ3_19: J3.19 ; port CSI1_GPIO
NetJ3_71: J3.71 ; port UART3_TXD
NetJ3_73: J3.73 ; port UART3_RXD
NetJ3_75: J3.75 ; port UART3_RTS
NetJ3_77: J3.77 ; port UART3_CTS
NetR35_2: R35.2 R42.2 ; port CSI1_PIXCLK_R

Not connected (* = marked no-connect by the designer): J1 25* 26* 27* 28* 31* 32* 33* 34* 37* 39* 91* 93* 97* 98* 99* 100*; J2 1* 20* 91* 93* 97* 99*; J3 13* 15* 17* 18* 21* 23* 24* 26* 27* 29* 30* 31* 32* 33* 34* 36* 37* 39* 40* 41* 42* 43* 44* 46* 47* 49* 51* 53* 57* 59* 61* 63* 65* 67* 81* 82* 83* 84* 85* 86* 87* 88* 89* 90* 93* 94* 95* 96* 97* 98* 99* 100*

### Layout directives
net class MIPI_CSI: CSI1_PIXCLK
net class GPIO: CPU_GPIO0_R

### Notes on the sheet
- CONNECTORS
- DESIGN NOTE:
  +VIN must be provided from baseboard to the module. Maximum current 3.6A.
- DESIGN NOTE:
  *1 Be careful, these pins are connected to +3V0_ALWAYS.
- DESIGN NOTE:
  *4 These pins have an internal 100k pull down resistor before RESET.
- DESIGN NOTE:
  *6 These pins use different naming in module and in baseboard schematic. Be sure you set these pins correctly according to the version of the baseboard.
- (Output voltage from BB)
- +VIN = +2.7-5.5 VDC
- DESIGN NOTE:
  *2 This pin must not be left unconnected (See Power Sequencing Page 16).
- DESIGN NOTE:
  *5 These pins are set as output with unknown state before the reset. See Table 103 page 167 in IMX6DQAEC.
- DESIGN NOTE:
  Optional: If ON-OFF operation is required 3V0_ALWAYS source is needed. Testing required.
- DESIGN NOTE:
  Connector J3 is optional - signals on this connector are not required in the booting process.
- level 5V
- *1
- (near J2) *2
- Def: Input PD
- *6
- *4
- (near J2) *4
- (near J3) *4
- Def: Output low
- DESIGN NOTE:
  +3V3 must be provided from baseboard to the module. Typical current 700mA.
- DESIGN NOTE:
  +2V5 required current 350mA
- Optional in future? (Output from BB)
- *5
- Def: Output high
- DESIGN NOTE:
  +5V must be provided from baseboard to the module. Typical current 300mA.
- LAYOUT NOTE:
  If 1.5mm standoff Board to Board connector is used, do not place any components under the module.
- DESIGN NOTE:
  Mating connector default: DF40C-100DP-0.4V(51)
  http://www.digikey.com/product-detail/en/DF40C-100DP-0.4V%2851%29/H11614TR-ND/1969475
- DESIGN NOTE:
  Use one of the options to fit series resistors according to the picture below.
- CPU GPIO0_R
- CPU PIXCLK
- SYS HDR
- CSI CON
- DESIGN NOTE:
  Maximum current for the board to board connector is 0.3A per contact.
- OPTION 1 (default):
- CPU GPIO0_R to SYS HDR
- 0R
- CPU PIXCLK to CSI CON
- OPTION 2:
- CPU GPIO0_R to CSI CON
- R43
- R35
- Free for personal and commercial use.
- R42
- Variant:
- Checked by
- (in symbol SDTitleBlock) Title:; Page Contents:; Revision:; Size:; DWG NO; Date:; Sheet; of

### Library data of the parts
C1-C3 C16 C231 C232 = C1608X5R0J226M080AC: CAP CER 22UF 6.3V 20% X5R 0603; Manufacturer: TDK Corporation; Capacitance: 22µF; .Creator: MM; Supplier 1: Digi-Key; Manufacturer Part Number: C1608X5R0J226M080AC; RoHS: RoHS Compliant; Category: Capacitors; Stock 1: 593047; Pricing 1: 1=0.39, 10=0.343, 100=0.1714, 250=0.13708, 500=0.12484, 1000=0.1104 (USD); Packaging: Cut Tape (CT); Tolerance: ±20%; Voltage - Rated: 6.3V; Temperature Coefficient: X5R; Mounting Type: Surface Mount, MLCC; Operating Temperature: -55°C ~ 85°C; Applications: General Purpose; Ratings: -; Package / Case: 0603 (1608 Metric); Size / Dimension: 0.063" L x 0.031" W (1.60mm x 0.80mm); Height - Seated (Max): -; Thickness (Max): 0.039" (1.00mm); Lead Spacing: -; Features: -; Lead Style: -; ComponentLink1URL: http://product.tdk.com/en/catalog/datasheets/mlcc_commercial_general_en.pdf; ComponentLink1Description: http://product.tdk.com/en/catalog/datasheets/mlcc_commercial_general_en.pdf; Supplier Part Number 1: 445-8028-1-ND; .Checked PCB: MM; .Checked SCH: MM
C4-C7 C12-C15 = C1005X5R1H104K: CAP CER .10UF 50V X5R 10% 0402; Manufacturer: TDK Corporation; Capacitance: 0.1µF; Value: 100nF; .Checked PCB: used; Category: Capacitors; Supplier Part Number: 445-5942-1-ND; Manufacturer Part Number: C1005X5R1H104K; Operating Temperature: -55°C ~ 85°C; Package / Case: 0402 (1005 Metric); Price 1k [$]: 0.02340; .Checked SCH: used; Voltage - Rated: 50V; Supplier: Digikey; Supplier 1: Digi-Key; Supplier Part Number 1: 445-5942-1-ND; RoHS: RoHS Compliant; Stock 1: 106926; Pricing 1: 1=0.27, 10=0.18, 100=0.072, 250=0.05176, 500=0.0369, 1000=0.027 (USD); Tolerance: ±10%; Temperature Coefficient: X5R; Mounting Type: Surface Mount, MLCC; Applications: General Purpose; Ratings: -; Size / Dimension: 0.039" L x 0.020" W (1.00mm x 0.50mm); Height - Seated (Max): -; Thickness (Max): 0.022" (0.55mm); Lead Spacing: -; Features: -; Packaging: Cut Tape (CT); Lead Style: -; ComponentLink1URL: http://www.tdk.co.jp/tefe02/e412_c.pdf; ComponentLink1Description: http://www.tdk.co.jp/tefe02/e412_c.pdf
J1-J3 = DF40C-100DS-0.4V(51)_v1.1: CONN RCPT 100POS 0.4MM SMD GOLD; Manufacturer: Hirose Electric Co Ltd; Connector Type: Receptacle, Center Strip Contacts; Number of Positions: 100; Pitch: 0.016" (0.40mm); Mated Stacking Heights: 1.5mm; .Creator: MM; Supplier 1: Digi-Key; Manufacturer Part Number: DF40C-100DS-0.4V(51); RoHS: RoHS Compliant; Category: Connectors, Interconnects; Stock 1: 35907; Pricing 1: 1=1.84, 10=1.671, 25=1.5688, 50=1.5004, 100=1.4322, 250=1.2958, 500=1.1935, 1000=1.023, 2500=0.9548 (USD); Packaging: Cut Tape (CT); Number of Rows: 2; Mounting Type: Surface Mount; Features: -; Contact Finish: Gold; Contact Finish Thickness: -; Height Above Board: 0.057" (1.45mm); ComponentLink1URL: http://www.hirose.co.jp/cataloge_hp/ed_DF40_20140305.pdf; ComponentLink1Description: http://www.hirose.co.jp/cataloge_hp/ed_DF40_20140305.pdf; .Checked PCB: MM; .Checked SCH: MM; Supplier Part Number 1: H11615CT-ND
R35 R42 R43 = RC0402FR-0722RL: RES 22.0 OHM 1/16W 1% 0402 SMD; Manufacturer: Yageo; Resistance (Ohms): 22; Power (Watts): 0.063W, 1/16W; .Checked PCB: used; Temperature Coefficient: ±100ppm/°C; Category: Resistors; Supplier Part Number: 311-22.0LRCT-ND; Manufacturer Part Number: RC0402FR-0722RL; Package / Case: 0402 (1005 Metric); Price 1k [$]: 0.01421; Tolerance: ±1%; Value: 22R; .Checked SCH: used; Supplier: Digikey; Supplier 1: Digi-Key; Supplier Part Number 1: 311-22.0LRCT-ND; RoHS: RoHS Compliant; Stock 1: 943800; Pricing 1: 10=0.014, 50=0.0104, 100=0.0079, 250=0.00584, 500=0.00432, 1000=0.00288 (USD); Composition: Thick Film; Features: -; Size / Dimension: 0.039" L x 0.020" W (1.00mm x 0.50mm); Height: 0.016" (0.40mm); Number of Terminations: 2; Packaging: Cut Tape (CT); ComponentLink1URL: http://www.yageo.com/documents/recent/PYu-RC0402_51_RoHS_L_6.pdf; ComponentLink1Description: http://www.yageo.com/documents/recent/PYu-RC0402_51_RoHS_L_6.pdf
TP7 TP8 TP11 TP14 = TP_25MILC: Test Point 25mil

## Sheet [04] - VIDEO INPUT.SchDoc
size A2; DocumentNumber: 4; SheetNumber: 4; SheetTotal: 18
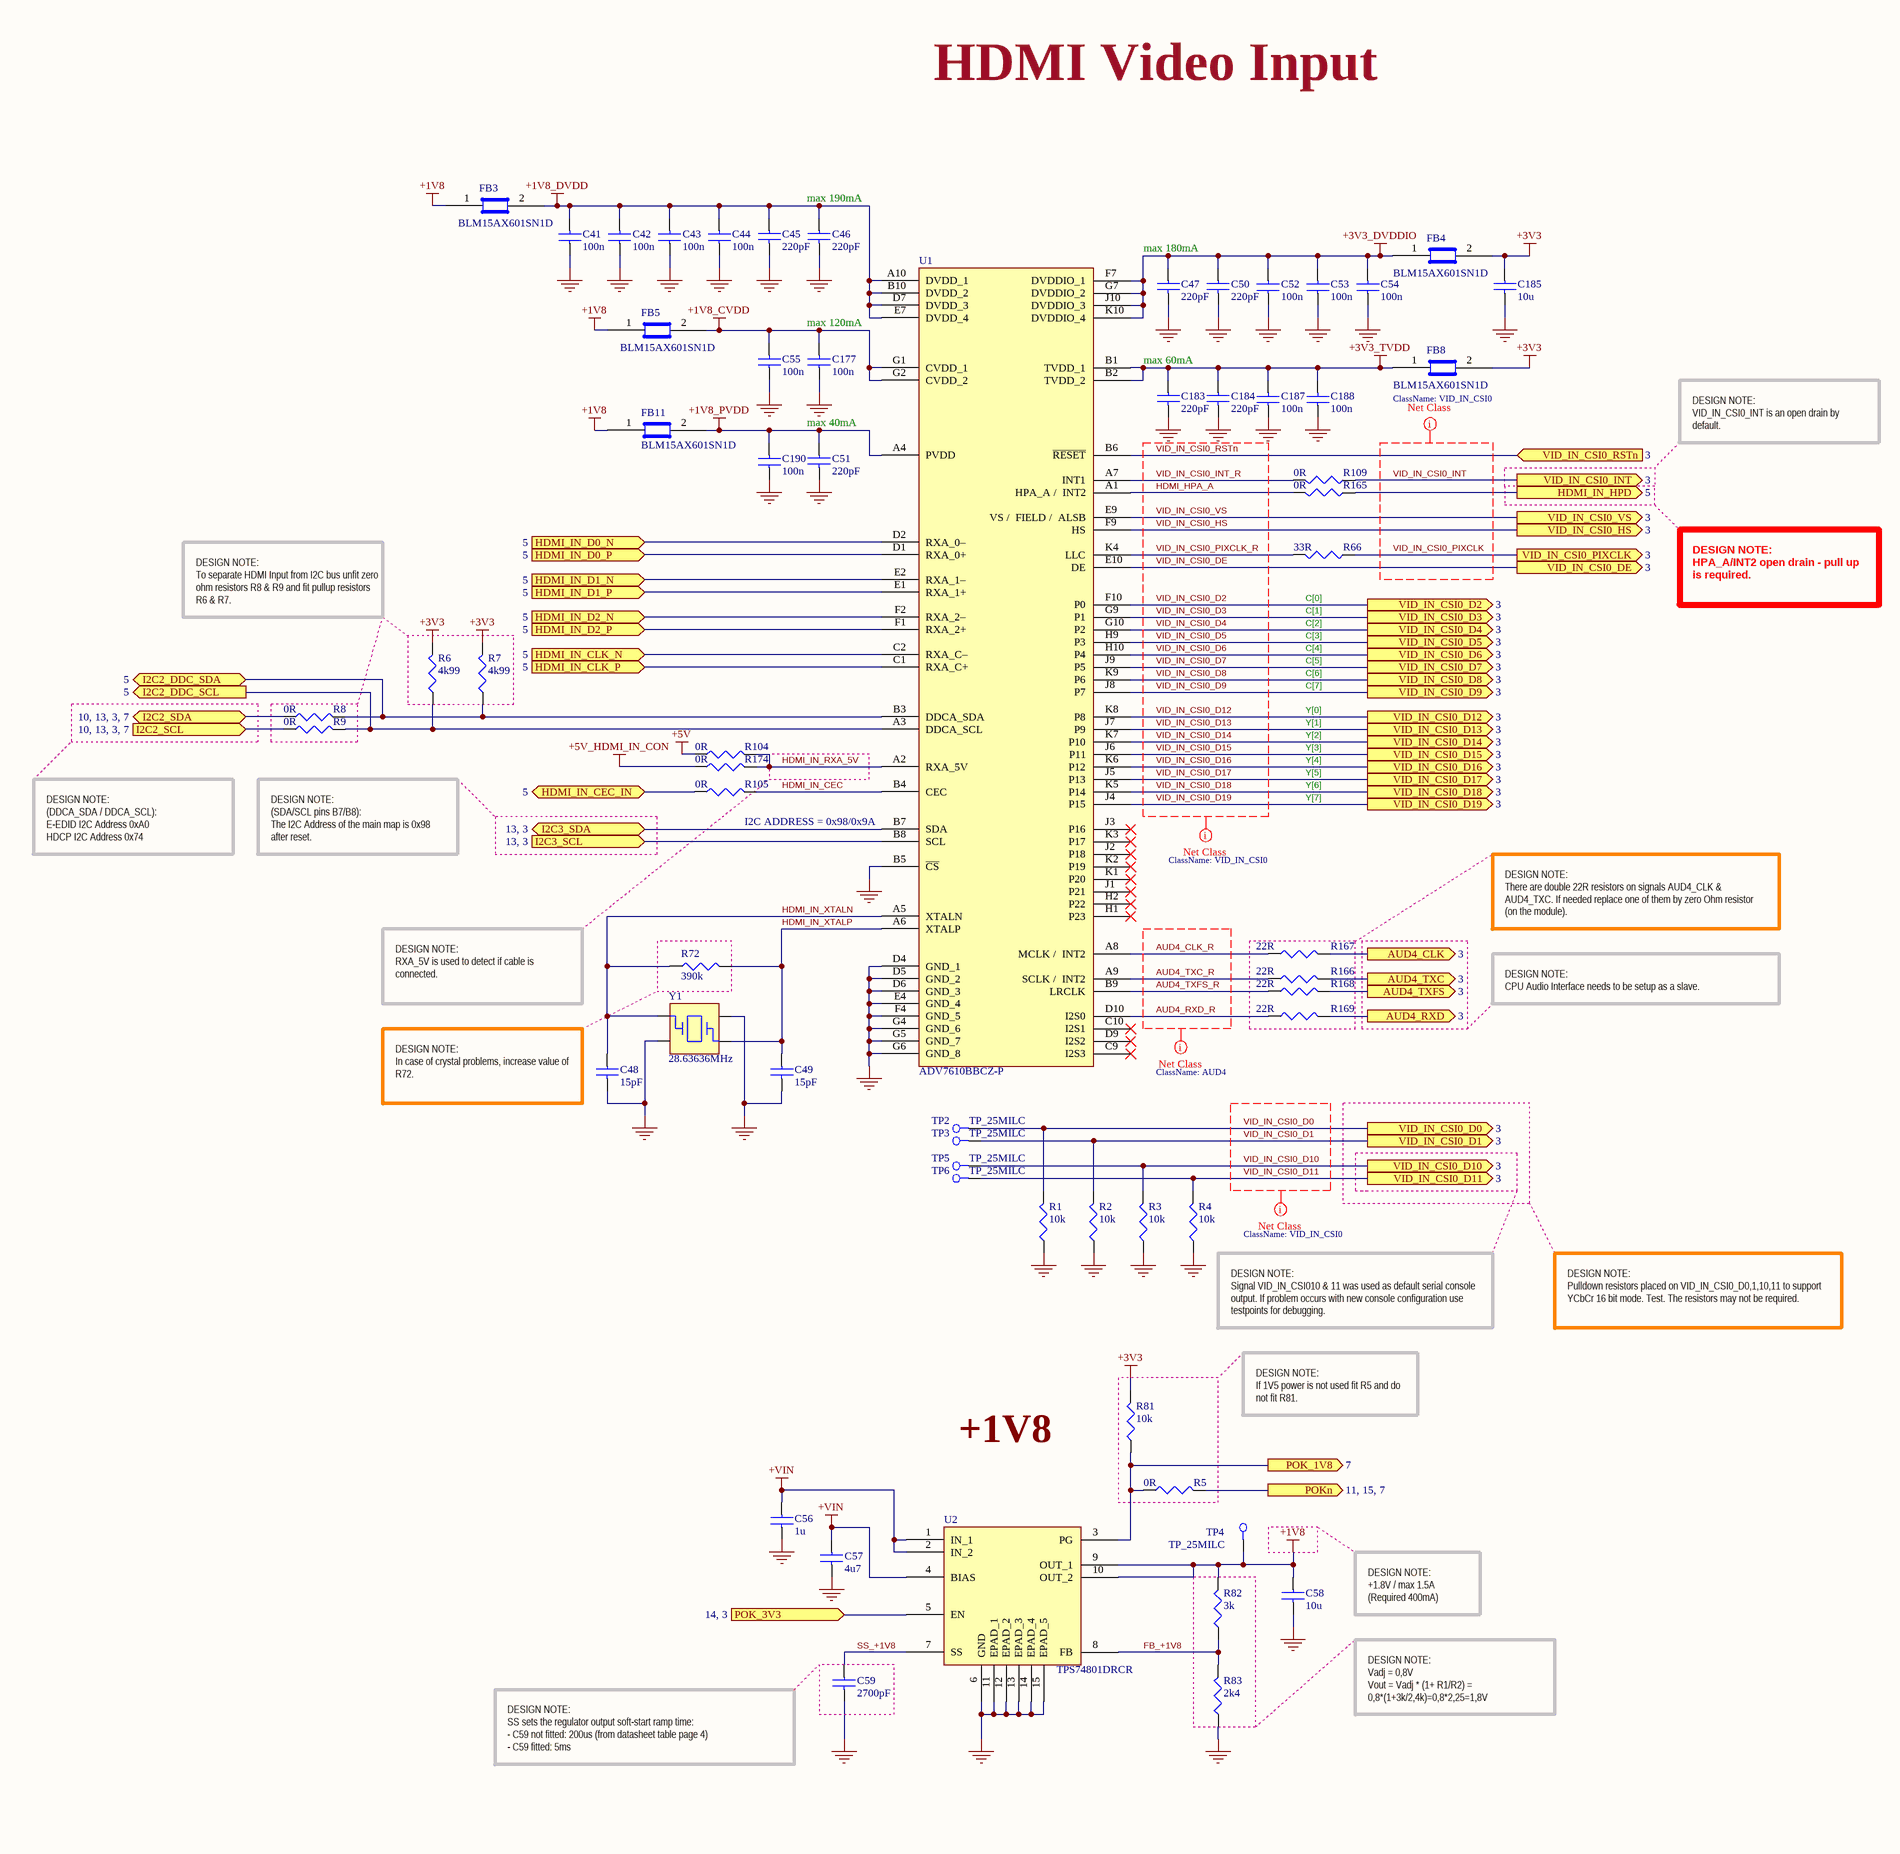
[diagram p5: [04] - VIDEO INPUT.SchDoc, left]
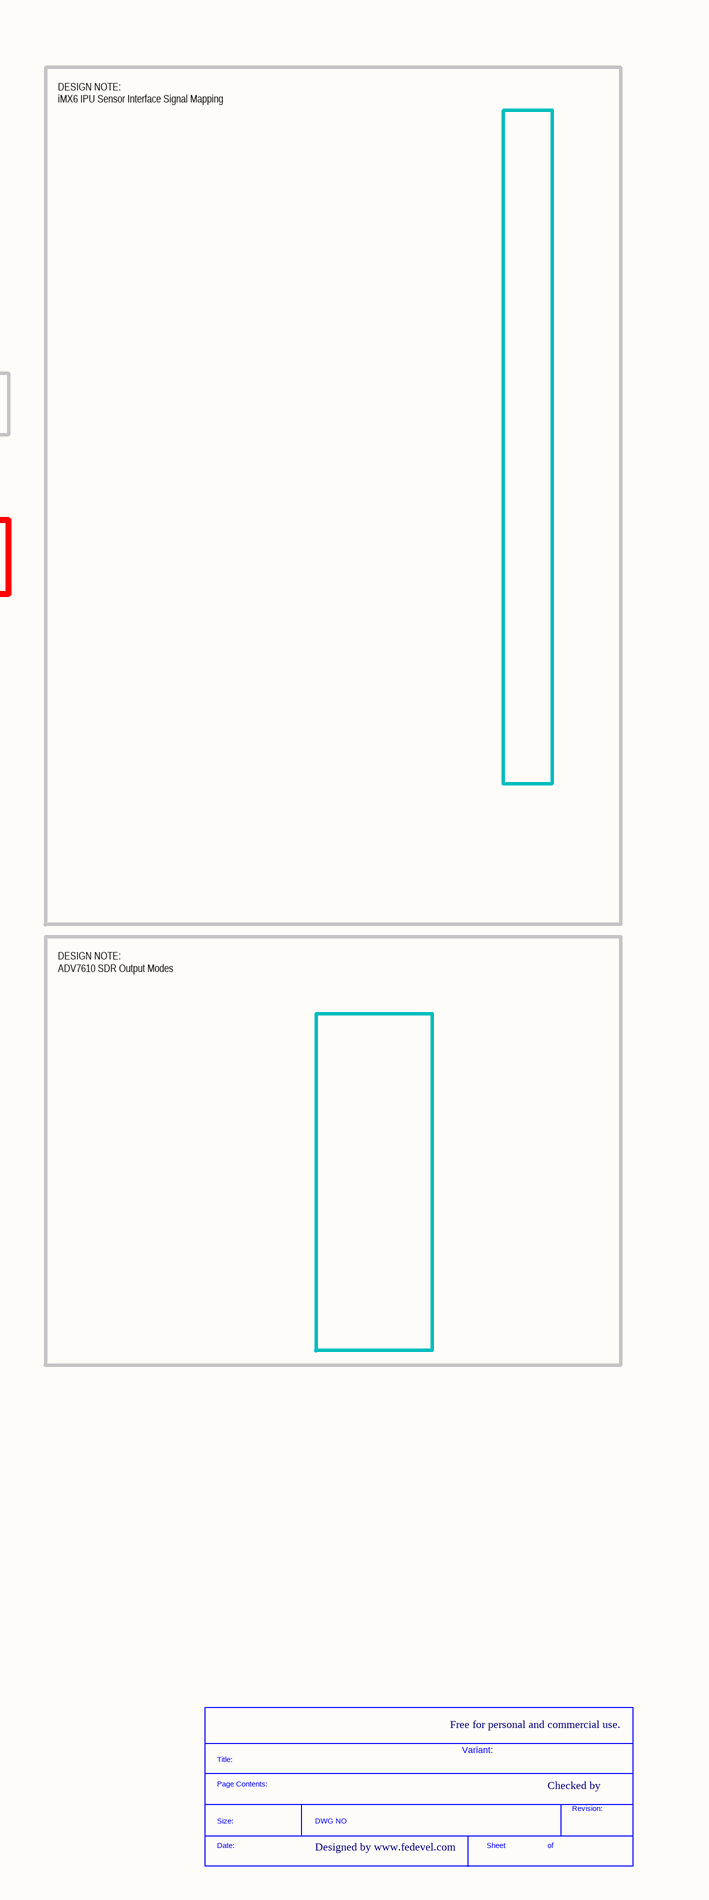
[diagram p6: [04] - VIDEO INPUT.SchDoc, right]

### Parts
(Parts that share a designator on the sheet are numbered #1, #2 ... from top to bottom, then left to right.)
*#4  SDTitleBlock  (value not drawn)  (graphical)
C41  100n  [C0402]
C42  100n  [C0402]
C43  100n  [C0402]
C44  100n  [C0402]
C45  220pF  [C0402]
C46  220pF  [C0402]
C47  220pF  [C0402]
C48  15pF  [C0402]
C49  15pF  [C0402]
C50  220pF  [C0402]
C51  220pF  [C0402]
C52  100n  [C0402]
C53  100n  [C0402]
C54  100n  [C0402]
C55  100n  [C0402]
C56  1u  [C0402]
C57  4u7  [C0402]
C58  10u  [C0603]
C59  2700pF  [C0402]
C177  100n  [C0402]
C183  220pF  [C0402]
C184  220pF  [C0402]
C185  10u  [C0603]
C187  100n  [C0402]
C188  100n  [C0402]
C190  100n  [C0402]
FB3  BLM15AX601SN1D  [C0402]
FB4  BLM15AX601SN1D  [C0402]
FB5  BLM15AX601SN1D  [C0402]
FB8  BLM15AX601SN1D  [C0402]
FB11  BLM15AX601SN1D  [C0402]
R1  10k  [R0402]
R2  10k  [R0402]
R3  10k  [R0402]
R4  10k  [R0402]
R5  0R  [R0402]
R6  4k99  [R0402]
R7  4k99  [R0402]
R8  0R  [R0402]
R9  0R  [R0402]
R66  33R  [R0402]
R72  390k  [R0402]
R81  10k  [R0402]
R82  3k  [R0402]
R83  2k4  [R0402]
R104  0R  [R0402]
R105  0R  [R0402]
R109  0R  [R0402]
R165  0R  [R0402]
R166  22R  [R0402]
R167  22R  [R0402]
R168  22R  [R0402]
R169  22R  [R0402]
R174  0R  [R0402]
TP2  TP_25MILC  [TP_25C]  (no BOM)
TP3  TP_25MILC  [TP_25C]  (no BOM)
TP4  TP_25MILC  [TP_25C]  (no BOM)
TP5  TP_25MILC  [TP_25C]  (no BOM)
TP6  TP_25MILC  [TP_25C]  (no BOM)
U1  ADV7610BBCZ-P  [76_CSP_BGA]
U2  TPS74801DRCR  [DRC (S-PVSON-N10)]
Y1  28.63636MHz  [ABM3B]

### Ports
AUD4_CLK (out, see 3), AUD4_RXD (out, see 3), AUD4_TXC (out, see 3), AUD4_TXFS (out, see 3), HDMI_IN_CEC_IN (bidir, see 5), HDMI_IN_CLK_N (in, see 5), HDMI_IN_CLK_P (in, see 5), HDMI_IN_D0_N (in, see 5), HDMI_IN_D0_P (in, see 5), HDMI_IN_D1_N (in, see 5), HDMI_IN_D1_P (in, see 5), HDMI_IN_D2_N (in, see 5), HDMI_IN_D2_P (in, see 5), HDMI_IN_HPD (out, see 5), I2C2_DDC_SCL (out, see 5), I2C2_DDC_SDA (bidir, see 5), I2C2_SCL (see 10, 13, 3, 7), I2C2_SDA (bidir, see 10, 13, 3, 7), I2C3_SCL (see 13, 3), I2C3_SDA (bidir, see 13, 3), POK_1V8 (out, see 7), POK_3V3 (see 14, 3), POKn (see 11, 15, 7), VID_IN_CSI0_D0 (out, see 3), VID_IN_CSI0_D1 (out, see 3), VID_IN_CSI0_D2 (out, see 3), VID_IN_CSI0_D3 (out, see 3), VID_IN_CSI0_D4 (out, see 3), VID_IN_CSI0_D5 (out, see 3), VID_IN_CSI0_D6 (out, see 3), VID_IN_CSI0_D7 (out, see 3), VID_IN_CSI0_D8 (out, see 3), VID_IN_CSI0_D9 (out, see 3), VID_IN_CSI0_D10 (out, see 3), VID_IN_CSI0_D11 (out, see 3), VID_IN_CSI0_D12 (out, see 3), VID_IN_CSI0_D13 (out, see 3), VID_IN_CSI0_D14 (out, see 3), VID_IN_CSI0_D15 (out, see 3), VID_IN_CSI0_D16 (out, see 3), VID_IN_CSI0_D17 (out, see 3), VID_IN_CSI0_D18 (out, see 3), VID_IN_CSI0_D19 (out, see 3), VID_IN_CSI0_DE (out, see 3), VID_IN_CSI0_HS (out, see 3), VID_IN_CSI0_INT (out, see 3), VID_IN_CSI0_PIXCLK (out, see 3), VID_IN_CSI0_RSTn (in, see 3), VID_IN_CSI0_VS (out, see 3)

### Nets
+1V8: C58.1 FB3.1 FB5.1 FB11.1 R82.2 TP4.1 U2.9(OUT_1) U2.10(OUT_2)
+1V8_CVDD: C55.2 C177.2 FB5.2 U1.G1(CVDD_1) U1.G2(CVDD_2)
+1V8_DVDD: C41.2 C42.2 C43.2 C44.2 C45.1 C46.1 FB3.2 U1.A10(DVDD_1) U1.B10(DVDD_2) U1.D7(DVDD_3) U1.E7(DVDD_4)
+1V8_PVDD: C51.1 C190.2 FB11.2 U1.A4(PVDD)
+3V3: C185.1 FB4.2 FB8.2 R6.2 R7.2 R81.2
+3V3_DVDDIO: C47.1 C50.1 C52.2 C53.2 C54.2 FB4.1 U1.F7(DVDDIO_1) U1.G7(DVDDIO_2) U1.J10(DVDDIO_3) U1.K10(DVDDIO_4)
+3V3_TVDD: C183.1 C184.1 C187.2 C188.2 FB8.1 U1.B1(TVDD_1) U1.B2(TVDD_2)
+5V: R104.1
+5V_HDMI_IN_CON: R174.1
+VIN: C56.1 C57.1 U2.1(IN_1) U2.2(IN_2) U2.4(BIAS)
GND: C41.1 C42.1 C43.1 C44.1 C45.2 C46.2 C47.2 C48.2 C49.2 C50.2 C51.2 C52.1 C53.1 C54.1 C55.1 C56.2 C57.2 C58.2 C59.2 C177.1 C183.2 C184.2 C185.2 C187.1 C188.1 C190.1 R1.1 R2.1 R3.1 R4.1 R83.1 U1.B5(~{CS}) U1.D4(GND_1) U1.D5(GND_2) U1.D6(GND_3) U1.E4(GND_4) U1.F4(GND_5) U1.G4(GND_6) U1.G5(GND_7) U1.G6(GND_8) U2.6(GND) U2.11(EPAD_1) U2.12(EPAD_2) U2.13(EPAD_3) U2.14(EPAD_4) U2.15(EPAD_5) Y1.2 Y1.4
AUD4_CLK_R: R167.1 U1.A8(MCLK_/__INT2)
AUD4_RXD_R: R169.1 U1.D10(I2S0)
AUD4_TXC_R: R166.1 U1.A9(SCLK_/__INT2)
AUD4_TXFS_R: R168.1 U1.B9(LRCLK)
FB_+1V8: R82.1 R83.2 U2.8(FB)
HDMI_HPA_A: R165.2 U1.A1(HPA_A_/__INT2)
HDMI_IN_CEC: R105.2 U1.B4(CEC)
HDMI_IN_CEC_IN: R105.1 ; port HDMI_IN_CEC_IN
HDMI_IN_CLK_N: U1.C2(RXA_C–) ; port HDMI_IN_CLK_N
HDMI_IN_CLK_P: U1.C1(RXA_C+) ; port HDMI_IN_CLK_P
HDMI_IN_D0_N: U1.D2(RXA_0–) ; port HDMI_IN_D0_N
HDMI_IN_D0_P: U1.D1(RXA_0+) ; port HDMI_IN_D0_P
HDMI_IN_D1_N: U1.E2(RXA_1–) ; port HDMI_IN_D1_N
HDMI_IN_D1_P: U1.E1(RXA_1+) ; port HDMI_IN_D1_P
HDMI_IN_D2_N: U1.F2(RXA_2–) ; port HDMI_IN_D2_N
HDMI_IN_D2_P: U1.F1(RXA_2+) ; port HDMI_IN_D2_P
HDMI_IN_HPD: R165.1 ; port HDMI_IN_HPD
HDMI_IN_RXA_5V: R104.2 R174.2 U1.A2(RXA_5V)
HDMI_IN_XTALN: C48.1 R72.1 U1.A5(XTALN) Y1.1
HDMI_IN_XTALP: C49.1 R72.2 U1.A6(XTALP) Y1.3
I2C2_DDC_SCL: R6.1 R9.2 U1.A3(DDCA_SCL) ; port I2C2_DDC_SCL
I2C2_DDC_SDA: R7.1 R8.2 U1.B3(DDCA_SDA) ; port I2C2_DDC_SDA
I2C2_SCL: R9.1 ; port I2C2_SCL
I2C2_SDA: R8.1 ; port I2C2_SDA
I2C3_SCL: U1.B8(SCL) ; port I2C3_SCL
I2C3_SDA: U1.B7(SDA) ; port I2C3_SDA
SS_+1V8: C59.1 U2.7(SS)
VID_IN_CSI0_D0: R1.2 TP2.1 ; port VID_IN_CSI0_D0
VID_IN_CSI0_D1: R2.2 TP3.1 ; port VID_IN_CSI0_D1
VID_IN_CSI0_D2: U1.F10(P0) ; port VID_IN_CSI0_D2
VID_IN_CSI0_D3: U1.G9(P1) ; port VID_IN_CSI0_D3
VID_IN_CSI0_D4: U1.G10(P2) ; port VID_IN_CSI0_D4
VID_IN_CSI0_D5: U1.H9(P3) ; port VID_IN_CSI0_D5
VID_IN_CSI0_D6: U1.H10(P4) ; port VID_IN_CSI0_D6
VID_IN_CSI0_D7: U1.J9(P5) ; port VID_IN_CSI0_D7
VID_IN_CSI0_D8: U1.K9(P6) ; port VID_IN_CSI0_D8
VID_IN_CSI0_D9: U1.J8(P7) ; port VID_IN_CSI0_D9
VID_IN_CSI0_D10: R3.2 TP5.1 ; port VID_IN_CSI0_D10
VID_IN_CSI0_D11: R4.2 TP6.1 ; port VID_IN_CSI0_D11
VID_IN_CSI0_D12: U1.K8(P8) ; port VID_IN_CSI0_D12
VID_IN_CSI0_D13: U1.J7(P9) ; port VID_IN_CSI0_D13
VID_IN_CSI0_D14: U1.K7(P10) ; port VID_IN_CSI0_D14
VID_IN_CSI0_D15: U1.J6(P11) ; port VID_IN_CSI0_D15
VID_IN_CSI0_D16: U1.K6(P12) ; port VID_IN_CSI0_D16
VID_IN_CSI0_D17: U1.J5(P13) ; port VID_IN_CSI0_D17
VID_IN_CSI0_D18: U1.K5(P14) ; port VID_IN_CSI0_D18
VID_IN_CSI0_D19: U1.J4(P15) ; port VID_IN_CSI0_D19
VID_IN_CSI0_DE: U1.E10(DE) ; port VID_IN_CSI0_DE
VID_IN_CSI0_HS: U1.F9(HS) ; port VID_IN_CSI0_HS
VID_IN_CSI0_INT: R109.1 ; port VID_IN_CSI0_INT
VID_IN_CSI0_INT_R: R109.2 U1.A7(INT1)
VID_IN_CSI0_PIXCLK: R66.1 ; port VID_IN_CSI0_PIXCLK
VID_IN_CSI0_PIXCLK_R: R66.2 U1.K4(LLC)
VID_IN_CSI0_RSTn: U1.B6(~{RESET}) ; port VID_IN_CSI0_RSTn
VID_IN_CSI0_VS: U1.E9(VS_/__FIELD_/__ALSB) ; port VID_IN_CSI0_VS
NetJ2_9: U2.5(EN) ; port POK_3V3
NetJ2_14: R167.2 ; port AUD4_CLK
NetJ2_16: R166.2 ; port AUD4_TXC
NetJ2_18: R168.2 ; port AUD4_TXFS
NetJ2_22: R169.2 ; port AUD4_RXD
NetQ4_1: R5.2 ; port POKn
NetR5_1: R5.1 R81.1 U2.3(PG) ; port POK_1V8

Not connected (* = marked no-connect by the designer): U1 C9(I2S3)* C10(I2S1)* D9(I2S2)* H1(P23)* H2(P22)* J1(P21)* J2(P18)* J3(P16)* K1(P20)* K2(P19)* K3(P17)*

### Layout directives
net class VID_IN_CSI0: HDMI_HPA_A, VID_IN_CSI0_D0, VID_IN_CSI0_D1, VID_IN_CSI0_D2, VID_IN_CSI0_D3, VID_IN_CSI0_D4, VID_IN_CSI0_D5, VID_IN_CSI0_D6, VID_IN_CSI0_D7, VID_IN_CSI0_D8, VID_IN_CSI0_D9, VID_IN_CSI0_D10, VID_IN_CSI0_D11, VID_IN_CSI0_D12, VID_IN_CSI0_D13, VID_IN_CSI0_D14, VID_IN_CSI0_D15, VID_IN_CSI0_D16, VID_IN_CSI0_D17, VID_IN_CSI0_D18, VID_IN_CSI0_D19, VID_IN_CSI0_DE, VID_IN_CSI0_HS, VID_IN_CSI0_INT, VID_IN_CSI0_INT_R, VID_IN_CSI0_PIXCLK, VID_IN_CSI0_PIXCLK_R, VID_IN_CSI0_RSTn, VID_IN_CSI0_VS
net class AUD4: AUD4_CLK_R, AUD4_RXD_R, AUD4_TXC_R, AUD4_TXFS_R

### Notes on the sheet
- HDMI Video Input
- DESIGN NOTE:
  iMX6 IPU Sensor Interface Signal Mapping
- (near C46) max 190mA
- max 180mA
- (near C177) max 120mA
- max 60mA
- (near C51) max 40mA
- DESIGN NOTE:
  VID_IN_CSI0_INT is an open drain by default.
- DESIGN NOTE:
  HPA_A/INT2 open drain - pull up is required.
- DESIGN NOTE:
  To separate HDMI Input from I2C bus unfit zero ohm resistors R8 & R9 and fit pullup resistors R6 & R7.
- (near R66) C[0]
- C[1]
- C[2]
- C[3]
- C[4]
- C[5]
- C[6]
- C[7]
- Y[0]
- Y[1]
- Y[2]
- Y[3]
- Y[4]
- Y[5]
- (near R105) I2C ADDRESS = 0x98/0x9A
- Y[6]
- Y[7]
- DESIGN NOTE:
  (DDCA_SDA / DDCA_SCL):
  E-EDID I2C Address 0xA0
  HDCP I2C Address 0x74
- DESIGN NOTE:
  (SDA/SCL pins B7/B8):
  The I2C Address of the main map is 0x98 after reset.
- DESIGN NOTE:
  There are double 22R resistors on signals AUD4_CLK & AUD4_TXC. If needed replace one of them by zero Ohm resistor (on the module).
- DESIGN NOTE:
  RXA_5V is used to detect if cable is connected.
- DESIGN NOTE:
  CPU Audio Interface needs to be setup as a slave.
- DESIGN NOTE:
  ADV7610 SDR Output Modes
- (near C48) DESIGN NOTE:
  In case of crystal problems, increase value of R72.
- (near R4) DESIGN NOTE:
  Signal VID_IN_CSI010 & 11 was used as default serial console output. If problem occurs with new console configuration use testpoints for debugging.
- DESIGN NOTE:
  Pulldown resistors placed on VID_IN_CSI0_D0,1,10,11 to support YCbCr 16 bit mode. Test. The resistors may not be required.
- +1V8
- DESIGN NOTE:
  If 1V5 power is not used fit R5 and do not fit R81.
- DESIGN NOTE:
  +1.8V / max 1.5A
  (Required 400mA)
- DESIGN NOTE:
  Vadj = 0,8V
  Vout = Vadj * (1+ R1/R2) = 0,8*(1+3k/2,4k)=0,8*2,25=1,8V
- DESIGN NOTE:
  SS sets the regulator output soft-start ramp time:
  - C59 not fitted: 200us (from datasheet table page 4)
  - C59 fitted: 5ms
- Free for personal and commercial use.
- Variant:
- Checked by
- Designed by www.fedevel.com
- (in symbol SDTitleBlock) Title:; Page Contents:; Revision:; Size:; DWG NO; Date:; Sheet; of

### Library data of the parts
C41-C44 C52-C55 C177 C187 C188 C190 = C1005X5R1H104K: as C4 on sheet [03] - CONNECTORS; Category: Capacitors; Supplier Part Number: 445-5942-1-ND; Manufacturer Part Number: C1005X5R1H104K; Operating Temperature: -55°C ~ 85°C; Package / Case: 0402 (1005 Metric); Price 1k [$]: 0.02340; .Checked SCH: used; Voltage - Rated: 50V; Supplier: Digikey; Supplier 1: Digi-Key; Supplier Part Number 1: 445-5942-1-ND; RoHS: RoHS Compliant; Stock 1: 106926; Pricing 1: 1=0.27, 10=0.18, 100=0.072, 250=0.05176, 500=0.0369, 1000=0.027 (USD); Tolerance: ±10%; Temperature Coefficient: X5R; Mounting Type: Surface Mount, MLCC; Applications: General Purpose; Ratings: -; Size / Dimension: 0.039" L x 0.020" W (1.00mm x 0.50mm); Height - Seated (Max): -; Thickness (Max): 0.022" (0.55mm); Lead Spacing: -; Features: -; Packaging: Cut Tape (CT); Lead Style: -; ComponentLink1URL: http://www.tdk.co.jp/tefe02/e412_c.pdf; ComponentLink1Description: http://www.tdk.co.jp/tefe02/e412_c.pdf
C45-C47 C50 C51 C183 C184 = C1005X7R1H221K: CAP CER 220PF 50V X7R 10% 0402; Manufacturer: TDK Corporation; .Checked PCB: used; Capacitance: 220pF; Category: Capacitors; Supplier Part Number: 445-1254-1-ND; Manufacturer Part Number: C1005X7R1H221K; Operating Temperature: -55°C ~ 125°C; Package / Case: 0402 (1005 Metric); Price 1k [$]: 0.00650; Value: 220pF; .Checked SCH: used; Voltage - Rated: 50V; Supplier: Digikey; Supplier 1: Digi-Key; Supplier Part Number 1: 445-1254-1-ND; RoHS: RoHS Compliant; Stock 1: 212041; Pricing 1: 1=0.08, 10=0.05, 100=0.018, 250=0.013, 500=0.0096, 1000=0.0065 (USD); Tolerance: ±10%; Temperature Coefficient: X7R; Mounting Type: Surface Mount, MLCC; Applications: General Purpose; Ratings: -; Size / Dimension: 0.039" L x 0.020" W (1.00mm x 0.50mm); Height - Seated (Max): -; Thickness (Max): 0.022" (0.55mm); Lead Spacing: -; Features: -; Packaging: Cut Tape (CT); Lead Style: -; ComponentLink1URL: http://www.tdk.co.jp/tefe02/e412_c.pdf; ComponentLink1Description: http://www.tdk.co.jp/tefe02/e412_c.pdf
C48 C49 = C1005C0G1H150J: CAP CER 15PF 50V 5% NP0 0402; Manufacturer: TDK Corporation; Temperature Coefficient: C0G, NP0; .Checked PCB: used; Supplier 1: Digi-Key; Supplier Part Number 1: 445-1237-1-ND; Manufacturer Part Number: C1005C0G1H150J; RoHS: RoHS Compliant; Category: Capacitors; Stock 1: 204632; Pricing 1: 10=0.024, 100=0.011, 250=0.009, 500=0.0077, 1000=0.006, 5000=0.005 (USD); Capacitance: 15pF; Voltage - Rated: 50V; Tolerance: ±5%; Mounting Type: Surface Mount, MLCC; Operating Temperature: -55°C ~ 125°C; Applications: General Purpose; Ratings: -; Package / Case: 0402 (1005 Metric); Size / Dimension: 0.039" L x 0.020" W (1.00mm x 0.50mm); Height - Seated (Max): -; Thickness (Max): 0.022" (0.55mm); Lead Spacing: -; Features: -; Packaging: Cut Tape (CT); Lead Style: -; ComponentLink1URL: http://www.tdk.com/pdf/general_B11.pdf; ComponentLink1Description: http://www.tdk.com/pdf/general_B11.pdf; .Checked SCH: used
C56 = C1005X5R1C105K: CAP CER 1.0UF 16V X5R 0402; Manufacturer: TDK Corporation; Capacitance: 1.0µF; Value: 1uF; .Checked PCB: used; Tolerance: ±10%; Category: Capacitors; Supplier Part Number: 445-4978-1-ND; Manufacturer Part Number: C1005X5R1C105K; Operating Temperature: -55°C ~ 85°C; Package / Case: 0402 (1005 Metric); Price 1k [$]: 0.02080; .Checked SCH: used; Voltage - Rated: 16V; Supplier: Digikey; Supplier 1: Digi-Key; Supplier Part Number 1: 445-4978-1-ND; RoHS: RoHS Compliant; Stock 1: 341010; Pricing 1: 1=0.24, 10=0.16, 100=0.064, 250=0.046, 500=0.0328, 1000=0.024 (USD); Temperature Coefficient: X5R; Mounting Type: Surface Mount, MLCC; Applications: General Purpose; Ratings: -; Size / Dimension: 0.039" L x 0.020" W (1.00mm x 0.50mm); Height - Seated (Max): -; Thickness (Max): 0.022" (0.55mm); Lead Spacing: -; Features: -; Packaging: Cut Tape (CT); Lead Style: -; ComponentLink1URL: http://www.tdk.co.jp/tefe02/e412_c.pdf; ComponentLink1Description: http://www.tdk.co.jp/tefe02/e412_c.pdf
C57 = C1005X5R1A475M: CAP CER 4.7UF 10V 20% X5R 0402; Manufacturer: TDK Corporation; Capacitance: 4.7µF; .Checked PCB: used; Supplier 1: Digi-Key; Supplier Part Number 1: 445-8023-1-ND; Manufacturer Part Number: C1005X5R1A475M; RoHS: RoHS Compliant; Category: Capacitors; Stock 1: 10140; Pricing 1: 1=0.53, 10=0.415, 100=0.25, 250=0.18752, 500=0.16, 1000=0.125, 5000=0.095 (USD); Voltage - Rated: 10V; Tolerance: ±20%; Temperature Coefficient: X5R; Mounting Type: Surface Mount, MLCC; Operating Temperature: -55°C ~ 85°C; Applications: General Purpose; Ratings: -; Package / Case: 0402 (1005 Metric); Size / Dimension: 0.039" L x 0.020" W (1.00mm x 0.50mm); Height - Seated (Max): -; Thickness (Max): -; Lead Spacing: -; Features: -; Packaging: Cut Tape (CT); Lead Style: -; ComponentLink1URL: http://www.tdk.com/pdf/general_B11.pdf; ComponentLink1Description: http://www.tdk.com/pdf/general_B11.pdf; .Checked SCH: used
C58 C185 = C1608X5R0J106M: CAP CER 10UF 6.3V X5R 20% 0603; Manufacturer: TDK Corporation; Capacitance: 10µF; Value: 10µF; .Checked PCB: used; Category: Capacitors; Supplier Part Number: 445-4112-1-ND; Manufacturer Part Number: C1608X5R0J106M; Operating Temperature: -55°C ~ 85°C; Package / Case: 0603 (1608 Metric); Price 1k [$]: 0.08580; .Checked SCH: used; Voltage - Rated: 6.3V; Features: Low ESR; Supplier: Digikey; Supplier 1: Digi-Key; Supplier Part Number 1: 445-4112-1-ND; RoHS: RoHS Compliant; Stock 1: 48157; Pricing 1: 1=0.46, 10=0.363, 100=0.1898, 250=0.14024, 500=0.1089, 1000=0.0858 (USD); Tolerance: ±20%; Temperature Coefficient: X5R; Mounting Type: Surface Mount, MLCC; Applications: General Purpose; Ratings: -; Size / Dimension: 0.063" L x 0.031" W (1.60mm x 0.80mm); Height - Seated (Max): -; Thickness (Max): 0.037" (0.95mm); Lead Spacing: -; Packaging: Cut Tape (CT); Lead Style: -; ComponentLink1URL: http://www.tdk.com/pdf/general_B11.pdf; ComponentLink1Description: http://www.tdk.com/pdf/general_B11.pdf
C59 = GRM155R71H272KA01D: CAP CER 2700PF 50V 10% X7R 0402; Manufacturer: Murata Electronics North America; .Checked PCB: used; Supplier 1: Digi-Key; Supplier Part Number 1: 490-1306-1-ND; Manufacturer Part Number: GRM155R71H272KA01D; RoHS: RoHS Compliant; Category: Capacitors; Stock 1: 38160; Pricing 1: 10=0.01, 50=0.0086, 100=0.0074, 250=0.00664, 500=0.00618, 750=0.00571, 1000=0.00542 (USD); Capacitance: 2700pF; Voltage - Rated: 50V; Tolerance: ±10%; Temperature Coefficient: X7R; Mounting Type: Surface Mount, MLCC; Operating Temperature: -55°C ~ 125°C; Applications: General Purpose; Ratings: -; Package / Case: 0402 (1005 Metric); Size / Dimension: 0.039" L x 0.020" W (1.00mm x 0.50mm); Height - Seated (Max): -; Thickness (Max): 0.022" (0.55mm); Lead Spacing: -; Features: -; Packaging: Cut Tape (CT); Lead Style: -; ComponentLink1URL: http://search.murata.co.jp/Ceramy/image/img/PDF/ENG/GRM155R71H272KA01.pdf; ComponentLink1Description: http://search.murata.co.jp/Ceramy/image/img/PDF/ENG/GRM155R71H272KA01.pdf; .Checked SCH: used
FB3-FB5 FB8 FB11 = BLM15AX601SN1D: FERRITE CHIP 600 OHM 0402 420mA; Manufacturer: Murata Electronics North America; .Checked PCB: used; Impedance @ Frequency: 600 Ohm @ 100MHz; DC Resistance (DCR): 340 mOhm Max; Filter Type: Differential Mode - Single; Number of Lines: 1; .Checked SCH: used; Category: Filters; Supplier Part Number: 490-5441-1-ND; Manufacturer Part Number: BLM15AX601SN1D; Package / Case: 0402 (1005 Metric); Price 1k [$]: 0.03280; Value: BLM15AX601SN1D; Current Rating: 420mA; Supplier: Digikey; Supplier 1: Digi-Key; Supplier Part Number 1: 490-5441-1-ND; RoHS: RoHS Compliant; Stock 1: 34008; Pricing 1: 1=0.26, 10=0.197, 50=0.1148, 100=0.0918, 250=0.0656, 500=0.0446, 1000=0.03608, 5000=0.02821 (USD); Mounting Type: Surface Mount; Packaging: Cut Tape (CT); Height (Max): 0.022" (0.55mm); Size / Dimension: 0.039" L x 0.020" W (1.00mm x 0.50mm); ComponentLink1URL: http://search.murata.co.jp/Ceramy/image/img/PDF/ENG/L0110S0100BLM15AX_SN.pdf; ComponentLink1Description: http://search.murata.co.jp/Ceramy/image/img/PDF/ENG/L0110S0100BLM15AX_SN.pdf
R1-R4 R81 = RC0402FR-0710KL: RES 10.0K OHM 1/16W 1% 0402 SMD; Manufacturer: Yageo; Power (Watts): 0.063W, 1/16W; .Checked PCB: used; Temperature Coefficient: ±100ppm/°C; Category: Resistors; Manufacturer Part Number: RC0402FR-0710KL; Package / Case: 0402 (1005 Metric); Price 1k [$]: 0.01421; Resistance (Ohms): 10K; Tolerance: ±1%; Value: 10k; .Checked SCH: used; Supplier Part Number: 311-10.0KLRCT-ND; Supplier: Digikey; Supplier 1: Digi-Key; Supplier Part Number 1: 311-10.0KLRCT-ND; RoHS: RoHS Compliant; Stock 1: 2916495; Pricing 1: 10=0.014, 50=0.0104, 100=0.0079, 250=0.00584, 500=0.00432, 1000=0.00288 (USD); Composition: Thick Film; Features: -; Size / Dimension: 0.039" L x 0.020" W (1.00mm x 0.50mm); Height: 0.016" (0.40mm); Number of Terminations: 2; Packaging: Cut Tape (CT); ComponentLink1URL: http://www.yageo.com/documents/recent/PYu-RC0402_51_RoHS_L_6.pdf; ComponentLink1Description: http://www.yageo.com/documents/recent/PYu-RC0402_51_RoHS_L_6.pdf
R5 R8 R9 R104 R105 R109 R165 R174 = RC0402JR-070RL: RES 0.0 OHM 1/16W 0402 SMD; Manufacturer: Yageo; Resistance (Ohms): 0.0; Power (Watts): 0.063W, 1/16W; Tolerance: Jumper; .Checked PCB: used; Category: Resistors; Manufacturer Part Number: RC0402JR-070RL; Package / Case: 0402 (1005 Metric); Price 1k [$]: 0.01389; Value: 0R; .Checked SCH: used; Supplier Part Number: 311-0.0JRCT-ND; Supplier: Digikey; Supplier 1: Digi-Key; Supplier Part Number 1: 311-0.0JRCT-ND; RoHS: RoHS Compliant; Stock 1: 1106330; Pricing 1: 10=0.012, 50=0.009, 100=0.0069, 250=0.00512, 500=0.0038, 1000=0.00253 (USD); Composition: Thick Film; Features: -; Temperature Coefficient: -; Size / Dimension: 0.039" L x 0.020" W (1.00mm x 0.50mm); Height: 0.016" (0.40mm); Number of Terminations: 2; Packaging: Cut Tape (CT); ComponentLink1URL: http://www.yageo.com/documents/recent/PYu-RC0402_51_RoHS_L_6.pdf; ComponentLink1Description: http://www.yageo.com/documents/recent/PYu-RC0402_51_RoHS_L_6.pdf
R6 R7 = RMCF0402FT4K99: RES TF 4.99K OHM 1% 1/16W 0402; Manufacturer: Stackpole Electronics Inc; Power (Watts): 0.063W, 1/16W; .Checked PCB: used; Temperature Coefficient: ±100ppm/°C; Category: Resistors; Supplier Part Number: RMCF0402FT4K99CT-ND; Manufacturer Part Number: RMCF0402FT4K99; Package / Case: 0402 (1005 Metric); Price 1k [$]: 0.00384; Resistance (Ohms): 4.99K; Tolerance: ±1%; Value: 4k99; .Checked SCH: used; Supplier: Digikey; Supplier 1: Digi-Key; Supplier Part Number 1: RMCF0402FT4K99CT-ND; RoHS: RoHS Compliant; Stock 1: 48509; Pricing 1: 1=0.04, 10=0.025, 50=0.0138, 100=0.0105, 250=0.0078, 500=0.00576, 1000=0.00384 (USD); Composition: Thick Film; Features: -; Size / Dimension: 0.039" L x 0.020" W (1.00mm x 0.50mm); Height: 0.016" (0.40mm); Number of Terminations: 2; Packaging: Cut Tape (CT); ComponentLink1URL: http://www.seielect.com/Catalog/SEI-RMCF.pdf; ComponentLink1Description: http://www.seielect.com/Catalog/SEI-RMCF.pdf
R66 = RMCF0402FT33R0: RES TF 33 OHM 1% 1/16W 0402; Manufacturer: Stackpole Electronics Inc; Resistance (Ohms): 33; Power (Watts): 0.063W, 1/16W; .Checked PCB: used; Temperature Coefficient: ±100ppm/°C; Category: Resistors; Supplier Part Number: RMCF0402FT33R0CT-ND; Manufacturer Part Number: RMCF0402FT33R0; Package / Case: 0402 (1005 Metric); Price 1k [$]: 0.00384; Tolerance: ±1%; Value: 33R; .Checked SCH: used; Supplier: Digikey; Supplier 1: Digi-Key; Supplier Part Number 1: RMCF0402FT33R0CT-ND; RoHS: RoHS Compliant; Stock 1: 26866; Pricing 1: 1=0.04, 10=0.025, 50=0.0138, 100=0.0105, 250=0.0078, 500=0.00576, 1000=0.00384 (USD); Composition: Thick Film; Features: -; Size / Dimension: 0.039" L x 0.020" W (1.00mm x 0.50mm); Height: 0.016" (0.40mm); Number of Terminations: 2; Packaging: Cut Tape (CT); ComponentLink1URL: http://www.seielect.com/Catalog/SEI-RMCF.pdf; ComponentLink1Description: http://www.seielect.com/Catalog/SEI-RMCF.pdf
R72 = CRCW0402390KFKED: RES 390K OHM 1/16W 1% 0402 SMD; Manufacturer: Vishay Dale; Power (Watts): 0.063W, 1/16W; Temperature Coefficient: ±100ppm/°C; .Creator: MM; .Checked SCH: used; Supplier 1: Digi-Key; Manufacturer Part Number: CRCW0402390KFKED; RoHS: RoHS Compliant; Category: Resistors; Stock 1: 288225; Pricing 1: 10=0.083, 50=0.0444, 200=0.0255, 1000=0.0174 (USD); Packaging: Cut Tape (CT); Resistance (Ohms): 390k; Tolerance: ±1%; Composition: Thick Film; Features: Automotive AEC-Q200 Qualified; Package / Case: 0402 (1005 Metric); Supplier Device Package: 0402 (1005 Metric); Size / Dimension: 0.039" L x 0.020" W (1.00mm x 0.50mm); Height: 0.016" (0.40mm); Number of Terminations: 2; ComponentLink1URL: http://www.vishay.com/docs/20035/dcrcwe3.pdf; ComponentLink1Description: http://www.vishay.com/docs/20035/dcrcwe3.pdf; Supplier Part Number 1: 541-390KLCT-ND; .Checked PCB: used
R82 = RC0402FR-073KL: RES 3K OHM 1/16W 1% 0402 SMD; Manufacturer: Yageo; Power (Watts): 0.063W, 1/16W; Temperature Coefficient: ±100ppm/°C; .Creator: MM; .Checked SCH: used; Supplier 1: Digi-Key; Manufacturer Part Number: RC0402FR-073KL; RoHS: RoHS Compliant; Category: Resistors; Stock 1: 194271; Pricing 1: 1=0.1, 10=0.014, 25=0.0104, 100=0.0063, 250=0.0054, 500=0.00382, 1000=0.0027, 2500=0.00234, 5000=0.00203 (USD); Packaging: Cut Tape (CT); Resistance (Ohms): 3k; Tolerance: ±1%; Composition: Thick Film; Features: -; Package / Case: 0402 (1005 Metric); Supplier Device Package: 0402; Size / Dimension: 0.039" L x 0.020" W (1.00mm x 0.50mm); Height: 0.016" (0.40mm); Number of Terminations: 2; ComponentLink1URL: http://www.yageo.com/documents/recent/PYu-RC0402_51_RoHS_L_6.pdf; ComponentLink1Description: http://www.yageo.com/documents/recent/PYu-RC0402_51_RoHS_L_6.pdf; Supplier Part Number 1: 311-3KLRCT-ND; .Checked PCB: used
R83 = CRCW04022K40FKED: RES 2.40K OHM 1/16W 1% 0402 SMD; Manufacturer: Vishay Dale; Resistance (Ohms): 2.4K; Power (Watts): 0.063W, 1/16W; Temperature Coefficient: ±100ppm/°C; .Checked PCB: used; Supplier 1: Digi-Key; Supplier Part Number 1: 541-2.40KLCT-ND; Manufacturer Part Number: CRCW04022K40FKED; RoHS: RoHS Compliant; Category: Resistors; Stock 1: 43967; Pricing 1: 10=0.083, 50=0.0444, 200=0.0255, 1000=0.0174 (USD); Composition: Thick Film; Features: -; Tolerance: ±1%; Package / Case: 0402 (1005 Metric); Size / Dimension: 0.039" L x 0.020" W (1.00mm x 0.50mm); Height: 0.016" (0.40mm); Number of Terminations: 2; Packaging: Cut Tape (CT); ComponentLink1URL: http://www.vishay.com/doc?20035; ComponentLink1Description: http://www.vishay.com/doc?20035; .Checked SCH: used
R166-R169 = RC0402FR-0722RL: as R35 on sheet [03] - CONNECTORS; Category: Resistors; Supplier Part Number: 311-22.0LRCT-ND; Manufacturer Part Number: RC0402FR-0722RL; Package / Case: 0402 (1005 Metric); Price 1k [$]: 0.01421; Tolerance: ±1%; Value: 22R; .Checked SCH: used; Supplier: Digikey; Supplier 1: Digi-Key; Supplier Part Number 1: 311-22.0LRCT-ND; RoHS: RoHS Compliant; Stock 1: 943800; Pricing 1: 10=0.014, 50=0.0104, 100=0.0079, 250=0.00584, 500=0.00432, 1000=0.00288 (USD); Composition: Thick Film; Features: -; Size / Dimension: 0.039" L x 0.020" W (1.00mm x 0.50mm); Height: 0.016" (0.40mm); Number of Terminations: 2; Packaging: Cut Tape (CT); ComponentLink1URL: http://www.yageo.com/documents/recent/PYu-RC0402_51_RoHS_L_6.pdf; ComponentLink1Description: http://www.yageo.com/documents/recent/PYu-RC0402_51_RoHS_L_6.pdf
TP2-TP6 = TP_25MILC: Test Point 25mil
U1 = ADV7610BBCZ-P: IC RCVR HDMI 165MHZ LP 76-CSBGA; Manufacturer: Analog Devices Inc; .Creator: MM; .Checked PCB: used; Supplier 1: Digi-Key; Manufacturer Part Number: ADV7610BBCZ-P; RoHS: RoHS Compliant; Category: Integrated Circuits (ICs); Stock 1: 47; Pricing 1: 1=14.23, 10=12.938, 100=10.9974, 250=10.02704, 500=9.38012, 1000=8.60384, 2500=8.484 (USD); Packaging: Tray; Type: HDMI, Receiver; Applications: Digital Video; Mounting Type: Surface Mount; Package / Case: 76-LFBGA, CSPBGA; Supplier Device Package: 76-CSPBGA (6x6); ComponentLink1URL: http://www.analog.com/static/imported-files/data_sheets/ADV7610.pdf; ComponentLink1Description: http://www.analog.com/static/imported-files/data_sheets/ADV7610.pdf; Supplier Part Number 1: ADV7610BBCZ-P-ND; .Checked SCH: used
U2 = TPS74801DRCR: IC REG LDO ADJ 1.5A 10SON; Manufacturer: Texas Instruments; Number of Regulators: 1; Regulator Topology: Positive Adjustable; Voltage - Input: 0.8 V ~ 5.5 V; Voltage - Output: 0.8 V ~ 3.6 V; Voltage - Dropout (Typical): 0.06V @ 1.5A; Current - Output: 1.5A (Max); Current - Limit (Min): 2A; .Creator: MM; .Checked PCB: used; Supplier 1: Digi-Key; Manufacturer Part Number: TPS74801DRCR; RoHS: RoHS Compliant; Category: Integrated Circuits (ICs); Stock 1: 11680; Pricing 1: 1=2.3, 10=2.074, 25=1.8576, 100=0.972, 250=0.954, 500=0.936, 750=0.918 (USD); Packaging: Cut Tape (CT); Operating Temperature: -40°C ~ 125°C; Mounting Type: Surface Mount; Package / Case: 10-VFDFN Exposed Pad; Supplier Device Package: 10-SON (3x3); ComponentLink1URL: http://www.ti.com/lit/ds/symlink/tps74801.pdf; ComponentLink1Description: http://www.ti.com/lit/ds/symlink/tps74801.pdf; Supplier Part Number 1: 296-21563-1-ND; .Checked SCH: used
Y1 = ABM3B-28.63636MHZ-10-1-U-T: CRYSTAL 28.63636MHZ 10PF SMD; Manufacturer: Abracon Corporation; Frequency Stability: ±10ppm; ESR (Equivalent Series Resistance): 50 Ohm; Operating Mode: Fundamental; .Creator: MM; .Checked PCB: MM, paper model not checked; Supplier 1: Digi-Key; Manufacturer Part Number: ABM3B-28.63636MHZ-10-1-U-T; RoHS: RoHS Compliant; Category: Crystals and Oscillators; Stock 1: 889; Pricing 1: 1=1.09, 10=0.968, 50=0.904, 100=0.8, 500=0.756 (USD); Packaging: Cut Tape (CT); Type: MHz Crystal; Frequency: 28.63636MHz; Frequency Tolerance: ±10ppm; Load Capacitance: 10pF; Operating Temperature: -10°C ~ 60°C; Ratings: -; Mounting Type: Surface Mount; Package / Case: 4-SMD, No Lead (DFN, LCC); Size / Dimension: 0.197" L x 0.126" W (5.00mm x 3.20mm); Height: 0.043" (1.10mm); ComponentLink1URL: http://www.abracon.com/Resonators/abm3b.pdf; ComponentLink1Description: http://www.abracon.com/Resonators/abm3b.pdf; Supplier Part Number 1: 300-8220-1-ND; .Checked SCH: MM